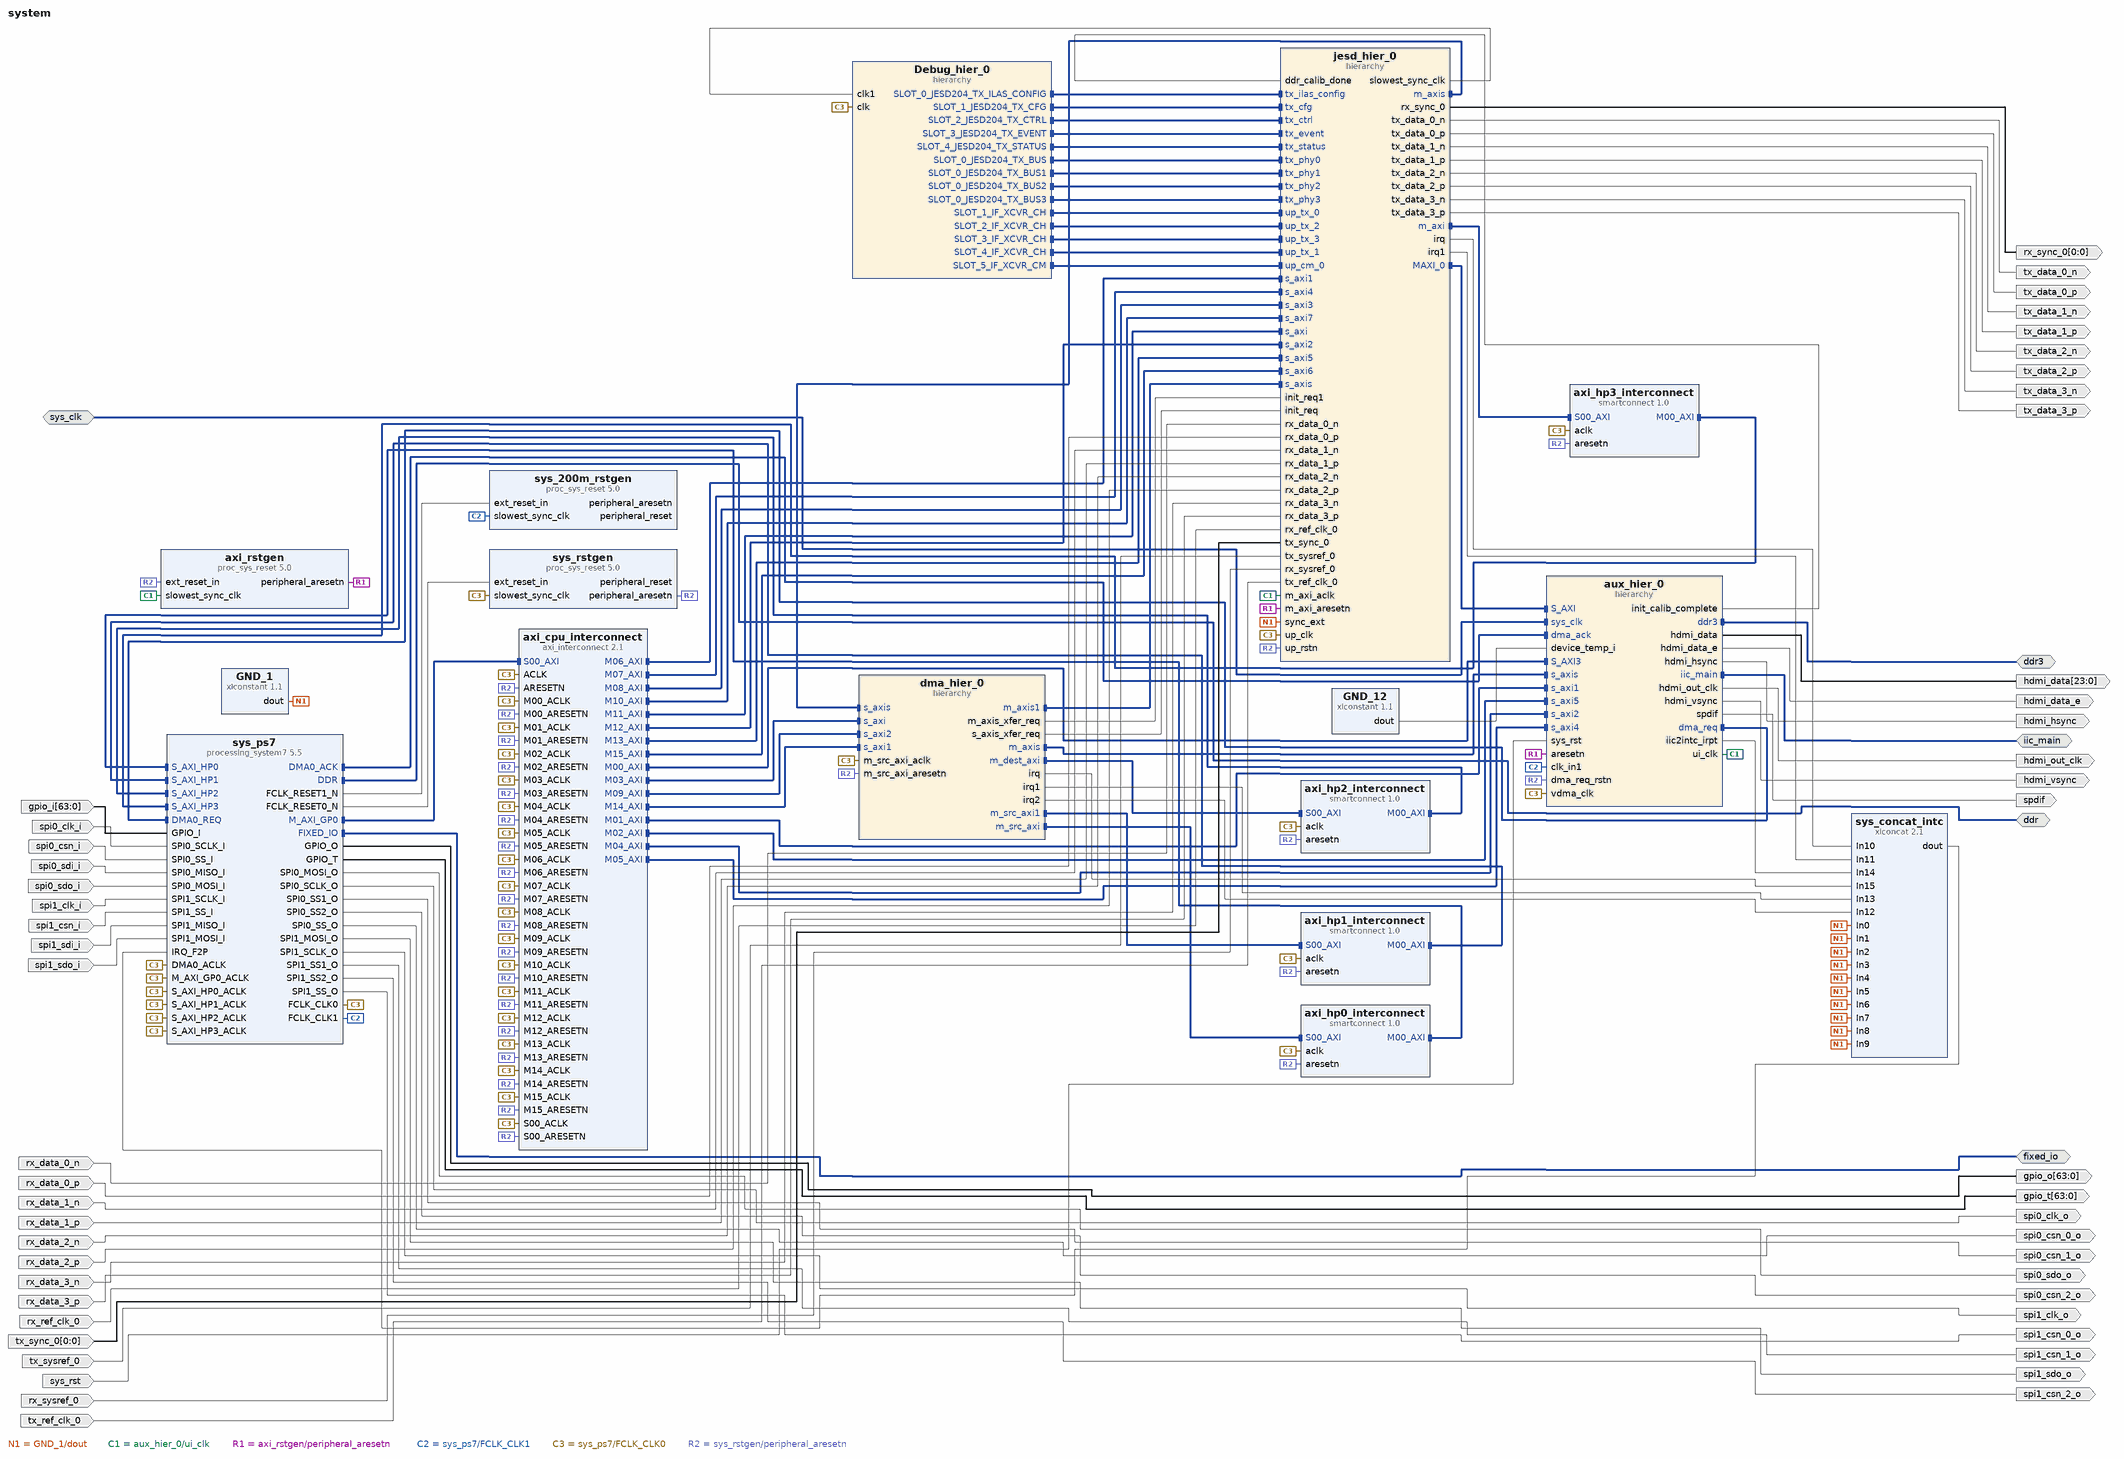
[diagram p0: block diagram of the top level]
# Vivado block design system, xc7z045ffg900-2, Vivado 2022.2
create_bd_design system

create_bd_intf_port -mode Master -vlnv xilinx.com:interface:ddrx_rtl:1.0 ddr
create_bd_intf_port -mode Master -vlnv xilinx.com:interface:iic_rtl:1.0 iic_main
create_bd_intf_port -mode Master -vlnv xilinx.com:display_processing_system7:fixedio_rtl:1.0 fixed_io
create_bd_intf_port -mode Slave -vlnv xilinx.com:interface:diff_clock_rtl:1.0 sys_clk
create_bd_intf_port -mode Master -vlnv xilinx.com:interface:ddrx_rtl:1.0 ddr3
create_bd_port -dir O spi0_csn_2_o
create_bd_port -dir O spi0_csn_1_o
create_bd_port -dir O spi0_csn_0_o
create_bd_port -dir I spi0_csn_i
create_bd_port -dir I spi0_clk_i
create_bd_port -dir O spi0_clk_o
create_bd_port -dir I spi0_sdo_i
create_bd_port -dir O spi0_sdo_o
create_bd_port -dir I spi0_sdi_i
create_bd_port -dir O spi1_csn_2_o
create_bd_port -dir O spi1_csn_1_o
create_bd_port -dir O spi1_csn_0_o
create_bd_port -dir I spi1_csn_i
create_bd_port -dir I spi1_clk_i
create_bd_port -dir O spi1_clk_o
create_bd_port -dir I spi1_sdo_i
create_bd_port -dir O spi1_sdo_o
create_bd_port -dir I spi1_sdi_i
create_bd_port -dir I -from 63 -to 0 gpio_i
create_bd_port -dir O -from 63 -to 0 gpio_o
create_bd_port -dir O -from 63 -to 0 gpio_t
create_bd_port -dir O hdmi_out_clk
create_bd_port -dir O hdmi_hsync
create_bd_port -dir O hdmi_vsync
create_bd_port -dir O hdmi_data_e
create_bd_port -dir O -from 23 -to 0 hdmi_data
create_bd_port -dir O spdif
create_bd_port -dir I tx_ref_clk_0
create_bd_port -dir I rx_ref_clk_0
create_bd_port -dir I tx_sysref_0
create_bd_port -dir I -from 0 -to 0 tx_sync_0
create_bd_port -dir O tx_data_0_p
create_bd_port -dir O tx_data_0_n
create_bd_port -dir O tx_data_1_p
create_bd_port -dir O tx_data_1_n
create_bd_port -dir O tx_data_2_p
create_bd_port -dir O tx_data_2_n
create_bd_port -dir O tx_data_3_p
create_bd_port -dir O tx_data_3_n
create_bd_port -dir I rx_sysref_0
create_bd_port -dir O -from 0 -to 0 rx_sync_0
create_bd_port -dir I rx_data_0_p
create_bd_port -dir I rx_data_0_n
create_bd_port -dir I rx_data_1_p
create_bd_port -dir I rx_data_1_n
create_bd_port -dir I rx_data_2_p
create_bd_port -dir I rx_data_2_n
create_bd_port -dir I rx_data_3_p
create_bd_port -dir I rx_data_3_n
create_bd_port -dir I -type rst sys_rst
set_property -dict {CONFIG.POLARITY ACTIVE_HIGH} [get_bd_ports sys_rst]

create_bd_cell -type ip -vlnv xilinx.com:ip:processing_system7:5.5 sys_ps7
set_property -dict [list \
  CONFIG.PCW_APU_PERIPHERAL_FREQMHZ 667.000000 \
  CONFIG.PCW_DUAL_PARALLEL_QSPI_DATA_MODE x8 \
  CONFIG.PCW_ENET0_ENET0_IO {MIO 16 .. 27} \
  CONFIG.PCW_ENET0_GRP_MDIO_ENABLE 1 \
  CONFIG.PCW_ENET0_GRP_MDIO_IO {MIO 52 .. 53} \
  CONFIG.PCW_ENET0_PERIPHERAL_ENABLE 1 \
  CONFIG.PCW_ENET0_PERIPHERAL_FREQMHZ {100 Mbps} \
  CONFIG.PCW_ENET0_RESET_ENABLE 1 \
  CONFIG.PCW_ENET0_RESET_IO {MIO 47} \
  CONFIG.PCW_ENET_RESET_ENABLE 1 \
  CONFIG.PCW_ENET_RESET_SELECT {Share reset pin} \
  CONFIG.PCW_EN_CLK1_PORT 1 \
  CONFIG.PCW_EN_CLK2_PORT 1 \
  CONFIG.PCW_EN_RST1_PORT 1 \
  CONFIG.PCW_EN_RST2_PORT 1 \
  CONFIG.PCW_FCLK_CLK1_BUF TRUE \
  CONFIG.PCW_FCLK_CLK2_BUF TRUE \
  CONFIG.PCW_FPGA0_PERIPHERAL_FREQMHZ 100.0 \
  CONFIG.PCW_FPGA1_PERIPHERAL_FREQMHZ 200.0 \
  CONFIG.PCW_FPGA_FCLK1_ENABLE 1 \
  CONFIG.PCW_FPGA_FCLK2_ENABLE 1 \
  CONFIG.PCW_GPIO_EMIO_GPIO_ENABLE 1 \
  CONFIG.PCW_GPIO_EMIO_GPIO_IO 64 \
  CONFIG.PCW_GPIO_MIO_GPIO_ENABLE 1 \
  CONFIG.PCW_GPIO_MIO_GPIO_IO MIO \
  CONFIG.PCW_I2C0_GRP_INT_ENABLE 0 \
  CONFIG.PCW_I2C0_I2C0_IO {MIO 50 .. 51} \
  CONFIG.PCW_I2C0_PERIPHERAL_ENABLE 1 \
  CONFIG.PCW_I2C0_RESET_ENABLE 1 \
  CONFIG.PCW_I2C0_RESET_IO {MIO 46} \
  CONFIG.PCW_I2C_PERIPHERAL_FREQMHZ 111.111115 \
  CONFIG.PCW_I2C_RESET_ENABLE 1 \
  CONFIG.PCW_I2C_RESET_SELECT {Share reset pin} \
  CONFIG.PCW_IRQ_F2P_INTR 1 \
  CONFIG.PCW_IRQ_F2P_MODE REVERSE \
  CONFIG.PCW_PRESET_BANK0_VOLTAGE {LVCMOS 1.8V} \
  CONFIG.PCW_PRESET_BANK1_VOLTAGE {LVCMOS 1.8V} \
  CONFIG.PCW_QSPI_GRP_FBCLK_ENABLE 1 \
  CONFIG.PCW_QSPI_GRP_FBCLK_IO {MIO 8} \
  CONFIG.PCW_QSPI_GRP_IO1_ENABLE 1 \
  CONFIG.PCW_QSPI_GRP_IO1_IO {MIO 0 9 .. 13} \
  CONFIG.PCW_QSPI_GRP_SINGLE_SS_ENABLE 0 \
  CONFIG.PCW_QSPI_INTERNAL_HIGHADDRESS 0xFDFFFFFF \
  CONFIG.PCW_QSPI_PERIPHERAL_ENABLE 1 \
  CONFIG.PCW_QSPI_QSPI_IO {MIO 1 .. 6} \
  CONFIG.PCW_SD0_GRP_CD_ENABLE 1 \
  CONFIG.PCW_SD0_GRP_CD_IO {MIO 14} \
  CONFIG.PCW_SD0_GRP_WP_ENABLE 1 \
  CONFIG.PCW_SD0_GRP_WP_IO {MIO 15} \
  CONFIG.PCW_SD0_PERIPHERAL_ENABLE 1 \
  CONFIG.PCW_SD0_SD0_IO {MIO 40 .. 45} \
  CONFIG.PCW_SDIO_PERIPHERAL_FREQMHZ 50 \
  CONFIG.PCW_SPI0_PERIPHERAL_ENABLE 1 \
  CONFIG.PCW_SPI0_SPI0_IO EMIO \
  CONFIG.PCW_SPI1_PERIPHERAL_ENABLE 1 \
  CONFIG.PCW_SPI1_SPI1_IO EMIO \
  CONFIG.PCW_UART1_PERIPHERAL_ENABLE 1 \
  CONFIG.PCW_UART1_UART1_IO {MIO 48 .. 49} \
  CONFIG.PCW_UART_PERIPHERAL_FREQMHZ 50 \
  CONFIG.PCW_UIPARAM_DDR_FREQ_MHZ 533.333313 \
  CONFIG.PCW_UIPARAM_DDR_PARTNO Custom \
  CONFIG.PCW_USB0_PERIPHERAL_ENABLE 1 \
  CONFIG.PCW_USB0_RESET_ENABLE 1 \
  CONFIG.PCW_USB0_RESET_IO {MIO 7} \
  CONFIG.PCW_USB0_USB0_IO {MIO 28 .. 39} \
  CONFIG.PCW_USB_RESET_ENABLE 1 \
  CONFIG.PCW_USB_RESET_SELECT {Share reset pin} \
  CONFIG.PCW_USE_DMA0 1 \
  CONFIG.PCW_USE_FABRIC_INTERRUPT 1 \
  CONFIG.PCW_USE_S_AXI_HP0 1 \
  CONFIG.PCW_USE_S_AXI_HP1 1 \
  CONFIG.PCW_USE_S_AXI_HP2 1 \
  CONFIG.PCW_USE_S_AXI_HP3 1 \
  CONFIG.preset ZC706 \
] [get_bd_cells sys_ps7]
# 242 more settings of sys_ps7 are not shown: defaults, MIO pin electricals, DDR timing, and values the tool derives
create_bd_cell -type ip -vlnv xilinx.com:ip:xlconcat:2.1 sys_concat_intc
set_property -dict {CONFIG.NUM_PORTS 16} [get_bd_cells sys_concat_intc]
create_bd_cell -type ip -vlnv xilinx.com:ip:proc_sys_reset:5.0 sys_rstgen
set_property -dict {CONFIG.C_EXT_RST_WIDTH 1} [get_bd_cells sys_rstgen]
create_bd_cell -type ip -vlnv xilinx.com:ip:proc_sys_reset:5.0 sys_200m_rstgen
set_property -dict {CONFIG.C_EXT_RST_WIDTH 1} [get_bd_cells sys_200m_rstgen]
create_bd_cell -type ip -vlnv xilinx.com:ip:xlconstant:1.1 GND_1
set_property -dict {CONFIG.CONST_VAL 0 CONFIG.CONST_WIDTH 1} [get_bd_cells GND_1]
create_bd_cell -type ip -vlnv xilinx.com:ip:axi_interconnect:2.1 axi_cpu_interconnect
set_property -dict {CONFIG.NUM_MI 16} [get_bd_cells axi_cpu_interconnect]
create_bd_cell -type ip -vlnv xilinx.com:ip:smartconnect:1.0 axi_hp0_interconnect
set_property -dict {CONFIG.NUM_MI 1 CONFIG.NUM_SI 1} [get_bd_cells axi_hp0_interconnect]
create_bd_cell -type ip -vlnv xilinx.com:ip:smartconnect:1.0 axi_hp3_interconnect
set_property -dict {CONFIG.NUM_MI 1 CONFIG.NUM_SI 1} [get_bd_cells axi_hp3_interconnect]
create_bd_cell -type ip -vlnv xilinx.com:ip:smartconnect:1.0 axi_hp1_interconnect
set_property -dict {CONFIG.NUM_MI 1 CONFIG.NUM_SI 1} [get_bd_cells axi_hp1_interconnect]
create_bd_cell -type ip -vlnv xilinx.com:ip:smartconnect:1.0 axi_hp2_interconnect
set_property -dict {CONFIG.NUM_MI 1 CONFIG.NUM_SI 1} [get_bd_cells axi_hp2_interconnect]
create_bd_cell -type ip -vlnv xilinx.com:ip:proc_sys_reset:5.0 axi_rstgen
create_bd_cell -type ip -vlnv xilinx.com:ip:xlconstant:1.1 GND_12
set_property -dict {CONFIG.CONST_VAL 0 CONFIG.CONST_WIDTH 12} [get_bd_cells GND_12]
create_bd_cell -type hier Debug_hier_0
create_bd_cell -type hier jesd_hier_0
create_bd_cell -type hier aux_hier_0
create_bd_cell -type hier dma_hier_0

# ---- hierarchy /Debug_hier_0 ----
current_bd_instance /Debug_hier_0
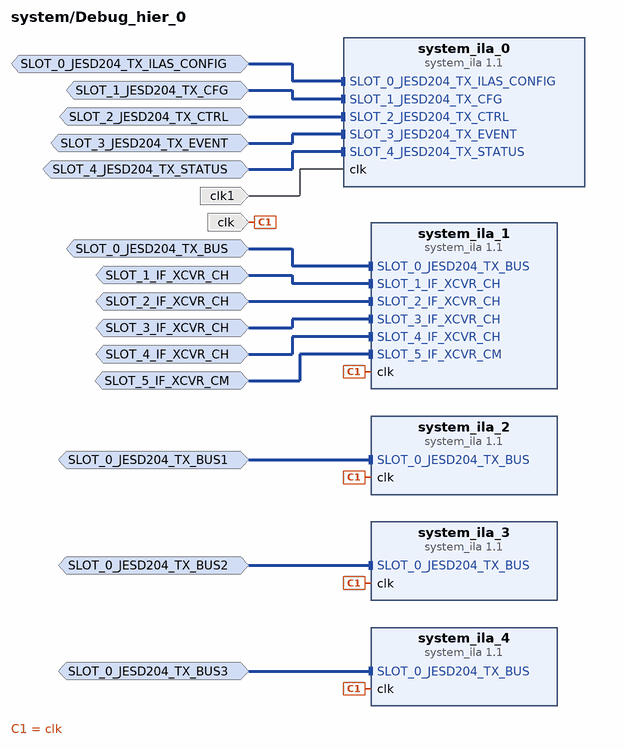
[diagram p1: block diagram inside /Debug_hier_0]
create_bd_intf_pin -mode Monitor -vlnv xilinx.com:display_jesd204:jesd204_tx_bus_rtl:1.0 SLOT_0_JESD204_TX_BUS
create_bd_intf_pin -mode Monitor -vlnv analog.com:interface:if_xcvr_ch_rtl:1.0 SLOT_1_IF_XCVR_CH
create_bd_intf_pin -mode Monitor -vlnv analog.com:interface:if_xcvr_ch_rtl:1.0 SLOT_2_IF_XCVR_CH
create_bd_intf_pin -mode Monitor -vlnv analog.com:interface:if_xcvr_ch_rtl:1.0 SLOT_3_IF_XCVR_CH
create_bd_intf_pin -mode Monitor -vlnv analog.com:interface:if_xcvr_ch_rtl:1.0 SLOT_4_IF_XCVR_CH
create_bd_intf_pin -mode Monitor -vlnv analog.com:interface:if_xcvr_cm_rtl:1.0 SLOT_5_IF_XCVR_CM
create_bd_intf_pin -mode Monitor -vlnv xilinx.com:display_jesd204:jesd204_tx_bus_rtl:1.0 SLOT_0_JESD204_TX_BUS1
create_bd_intf_pin -mode Monitor -vlnv xilinx.com:display_jesd204:jesd204_tx_bus_rtl:1.0 SLOT_0_JESD204_TX_BUS2
create_bd_intf_pin -mode Monitor -vlnv xilinx.com:display_jesd204:jesd204_tx_bus_rtl:1.0 SLOT_0_JESD204_TX_BUS3
create_bd_intf_pin -mode Monitor -vlnv analog.com:interface:jesd204_tx_ilas_config_rtl:1.0 SLOT_0_JESD204_TX_ILAS_CONFIG
create_bd_intf_pin -mode Monitor -vlnv analog.com:interface:jesd204_tx_cfg_rtl:1.0 SLOT_1_JESD204_TX_CFG
create_bd_intf_pin -mode Monitor -vlnv analog.com:interface:jesd204_tx_ctrl_rtl:1.0 SLOT_2_JESD204_TX_CTRL
create_bd_intf_pin -mode Monitor -vlnv analog.com:interface:jesd204_tx_event_rtl:1.0 SLOT_3_JESD204_TX_EVENT
create_bd_intf_pin -mode Monitor -vlnv analog.com:interface:jesd204_tx_status_rtl:1.0 SLOT_4_JESD204_TX_STATUS
create_bd_pin -dir I -type clk clk
create_bd_pin -dir I -type clk clk1

create_bd_cell -type ip -vlnv xilinx.com:ip:system_ila:1.1 system_ila_1
set_property -dict [list \
  CONFIG.C_MON_TYPE INTERFACE \
  CONFIG.C_NUM_MONITOR_SLOTS 6 \
  CONFIG.C_SLOT_0_INTF_TYPE xilinx.com:display_jesd204:jesd204_tx_bus_rtl:1.0 \
  CONFIG.C_SLOT_0_TYPE 0 \
  CONFIG.C_SLOT_1_INTF_TYPE analog.com:interface:if_xcvr_ch_rtl:1.0 \
  CONFIG.C_SLOT_1_TYPE 0 \
  CONFIG.C_SLOT_2_INTF_TYPE analog.com:interface:if_xcvr_ch_rtl:1.0 \
  CONFIG.C_SLOT_2_TYPE 0 \
  CONFIG.C_SLOT_3_INTF_TYPE analog.com:interface:if_xcvr_ch_rtl:1.0 \
  CONFIG.C_SLOT_3_TYPE 0 \
  CONFIG.C_SLOT_4_INTF_TYPE analog.com:interface:if_xcvr_ch_rtl:1.0 \
  CONFIG.C_SLOT_4_TYPE 0 \
  CONFIG.C_SLOT_5_INTF_TYPE analog.com:interface:if_xcvr_cm_rtl:1.0 \
  CONFIG.C_SLOT_5_TYPE 0 \
] [get_bd_cells system_ila_1]
create_bd_cell -type ip -vlnv xilinx.com:ip:system_ila:1.1 system_ila_2
set_property -dict [list \
  CONFIG.C_MON_TYPE INTERFACE \
  CONFIG.C_NUM_MONITOR_SLOTS 1 \
  CONFIG.C_SLOT_0_INTF_TYPE xilinx.com:display_jesd204:jesd204_tx_bus_rtl:1.0 \
  CONFIG.C_SLOT_0_TYPE 0 \
] [get_bd_cells system_ila_2]
create_bd_cell -type ip -vlnv xilinx.com:ip:system_ila:1.1 system_ila_3
set_property -dict [list \
  CONFIG.C_MON_TYPE INTERFACE \
  CONFIG.C_NUM_MONITOR_SLOTS 1 \
  CONFIG.C_SLOT_0_INTF_TYPE xilinx.com:display_jesd204:jesd204_tx_bus_rtl:1.0 \
  CONFIG.C_SLOT_0_TYPE 0 \
] [get_bd_cells system_ila_3]
create_bd_cell -type ip -vlnv xilinx.com:ip:system_ila:1.1 system_ila_4
set_property -dict [list \
  CONFIG.C_MON_TYPE INTERFACE \
  CONFIG.C_NUM_MONITOR_SLOTS 1 \
  CONFIG.C_SLOT_0_INTF_TYPE xilinx.com:display_jesd204:jesd204_tx_bus_rtl:1.0 \
  CONFIG.C_SLOT_0_TYPE 0 \
] [get_bd_cells system_ila_4]
create_bd_cell -type ip -vlnv xilinx.com:ip:system_ila:1.1 system_ila_0
set_property -dict [list \
  CONFIG.C_MON_TYPE INTERFACE \
  CONFIG.C_NUM_MONITOR_SLOTS 5 \
  CONFIG.C_SLOT_0_INTF_TYPE analog.com:interface:jesd204_tx_ilas_config_rtl:1.0 \
  CONFIG.C_SLOT_0_TYPE 0 \
  CONFIG.C_SLOT_1_INTF_TYPE analog.com:interface:jesd204_tx_cfg_rtl:1.0 \
  CONFIG.C_SLOT_1_TYPE 0 \
  CONFIG.C_SLOT_2_INTF_TYPE analog.com:interface:jesd204_tx_ctrl_rtl:1.0 \
  CONFIG.C_SLOT_2_TYPE 0 \
  CONFIG.C_SLOT_3_INTF_TYPE analog.com:interface:jesd204_tx_event_rtl:1.0 \
  CONFIG.C_SLOT_3_TYPE 0 \
  CONFIG.C_SLOT_4_INTF_TYPE analog.com:interface:jesd204_tx_status_rtl:1.0 \
  CONFIG.C_SLOT_4_TYPE 0 \
] [get_bd_cells system_ila_0]

# ---- hierarchy /jesd_hier_0 ----
current_bd_instance /jesd_hier_0
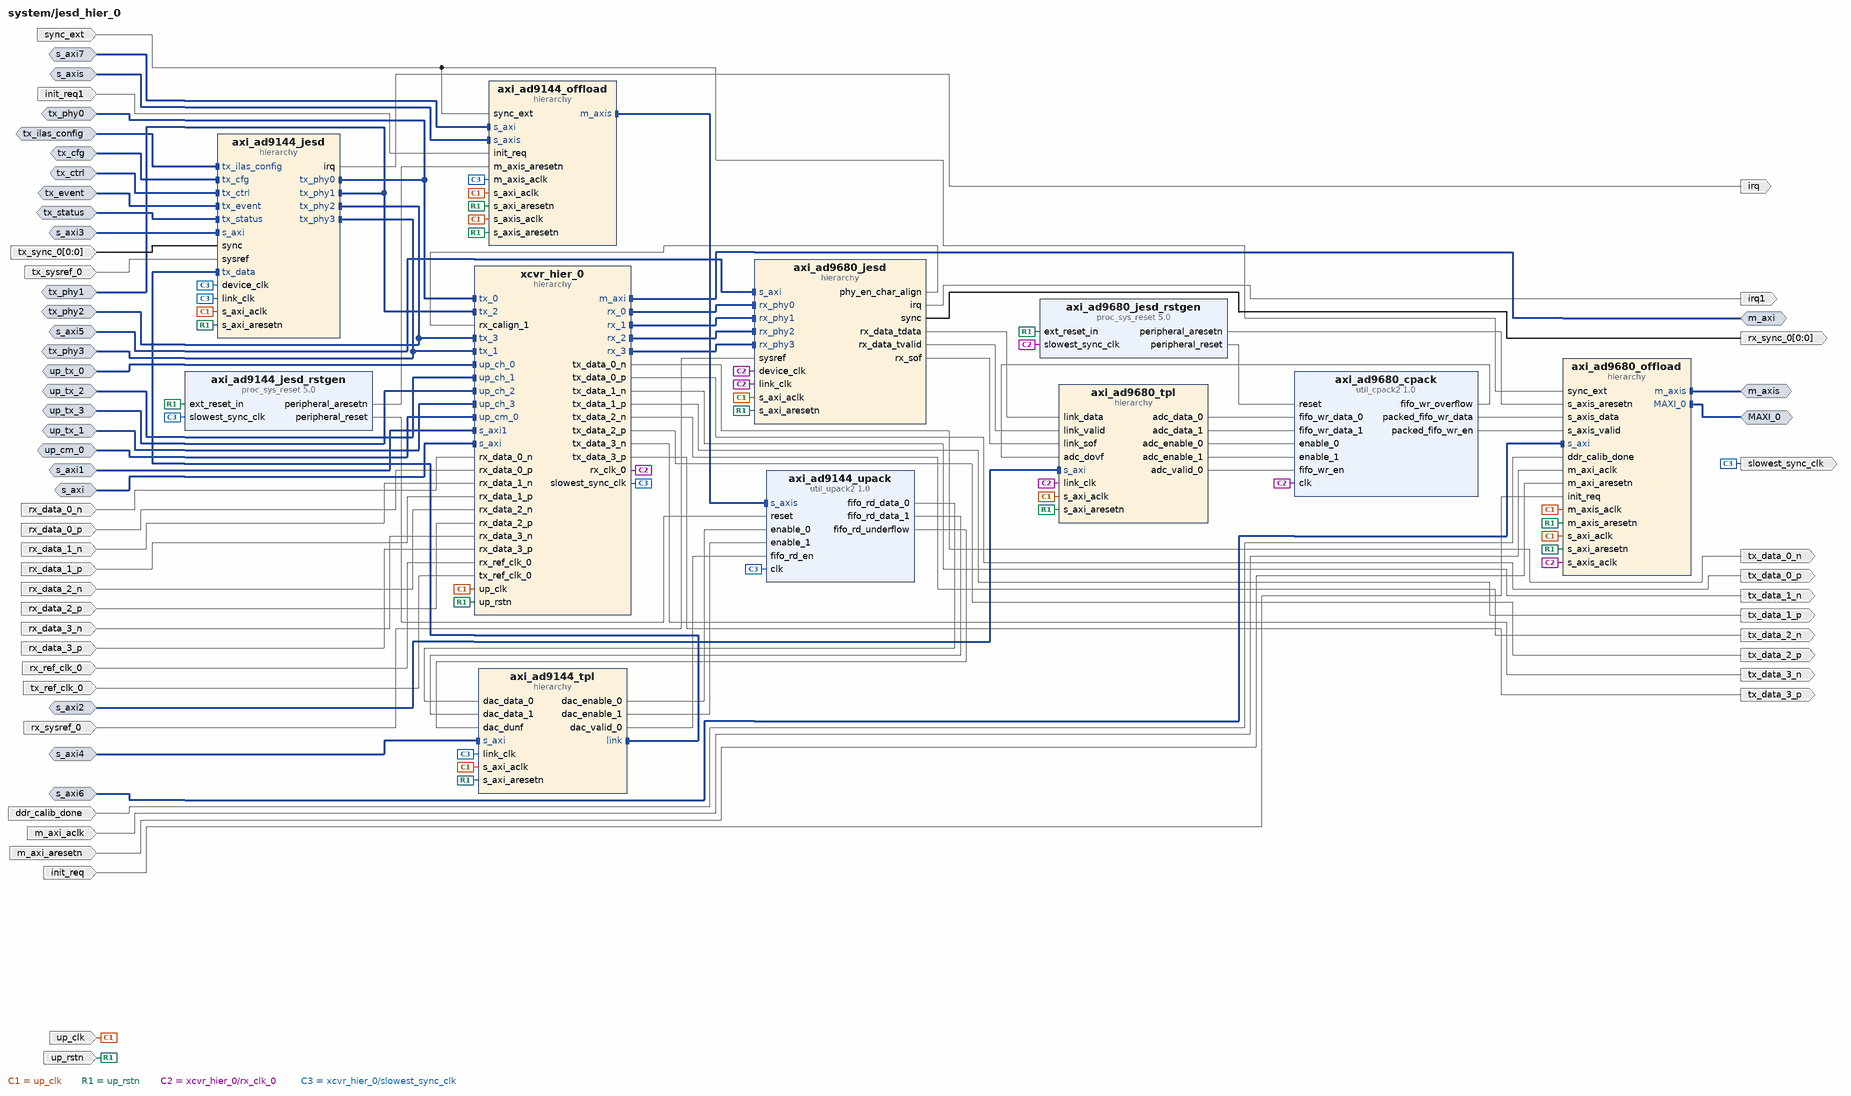
[diagram p2: block diagram inside /jesd_hier_0]
create_bd_intf_pin -mode Slave -vlnv xilinx.com:interface:aximm_rtl:1.0 s_axi
create_bd_intf_pin -mode Master -vlnv xilinx.com:interface:aximm_rtl:1.0 m_axi
create_bd_intf_pin -mode Slave -vlnv xilinx.com:interface:aximm_rtl:1.0 s_axi1
create_bd_intf_pin -mode Monitor -vlnv analog.com:interface:if_xcvr_cm_rtl:1.0 up_cm_0
create_bd_intf_pin -mode Monitor -vlnv analog.com:interface:if_xcvr_ch_rtl:1.0 up_tx_0
create_bd_intf_pin -mode Monitor -vlnv analog.com:interface:if_xcvr_ch_rtl:1.0 up_tx_2
create_bd_intf_pin -mode Monitor -vlnv analog.com:interface:if_xcvr_ch_rtl:1.0 up_tx_3
create_bd_intf_pin -mode Monitor -vlnv analog.com:interface:if_xcvr_ch_rtl:1.0 up_tx_1
create_bd_intf_pin -mode Monitor -vlnv xilinx.com:display_jesd204:jesd204_tx_bus_rtl:1.0 tx_phy0
create_bd_intf_pin -mode Monitor -vlnv xilinx.com:display_jesd204:jesd204_tx_bus_rtl:1.0 tx_phy3
create_bd_intf_pin -mode Monitor -vlnv xilinx.com:display_jesd204:jesd204_tx_bus_rtl:1.0 tx_phy1
create_bd_intf_pin -mode Monitor -vlnv xilinx.com:display_jesd204:jesd204_tx_bus_rtl:1.0 tx_phy2
create_bd_intf_pin -mode Slave -vlnv xilinx.com:interface:aximm_rtl:1.0 s_axi2
create_bd_intf_pin -mode Slave -vlnv xilinx.com:interface:aximm_rtl:1.0 s_axi3
create_bd_intf_pin -mode Monitor -vlnv analog.com:interface:jesd204_tx_ilas_config_rtl:1.0 tx_ilas_config
create_bd_intf_pin -mode Monitor -vlnv analog.com:interface:jesd204_tx_cfg_rtl:1.0 tx_cfg
create_bd_intf_pin -mode Monitor -vlnv analog.com:interface:jesd204_tx_ctrl_rtl:1.0 tx_ctrl
create_bd_intf_pin -mode Monitor -vlnv analog.com:interface:jesd204_tx_event_rtl:1.0 tx_event
create_bd_intf_pin -mode Monitor -vlnv analog.com:interface:jesd204_tx_status_rtl:1.0 tx_status
create_bd_intf_pin -mode Slave -vlnv xilinx.com:interface:aximm_rtl:1.0 s_axi4
create_bd_intf_pin -mode Slave -vlnv xilinx.com:interface:aximm_rtl:1.0 s_axi5
create_bd_intf_pin -mode Slave -vlnv xilinx.com:interface:aximm_rtl:1.0 s_axi6
create_bd_intf_pin -mode Master -vlnv xilinx.com:interface:axis_rtl:1.0 m_axis
create_bd_intf_pin -mode Master -vlnv xilinx.com:interface:aximm_rtl:1.0 MAXI_0
create_bd_intf_pin -mode Slave -vlnv xilinx.com:interface:aximm_rtl:1.0 s_axi7
create_bd_intf_pin -mode Slave -vlnv xilinx.com:interface:axis_rtl:1.0 s_axis
create_bd_pin -dir I -type clk up_clk
create_bd_pin -dir I -type rst up_rstn
create_bd_pin -dir I tx_ref_clk_0
create_bd_pin -dir I rx_ref_clk_0
create_bd_pin -dir I rx_data_0_p
create_bd_pin -dir I rx_data_0_n
create_bd_pin -dir O tx_data_0_p
create_bd_pin -dir O tx_data_0_n
create_bd_pin -dir O -type clk slowest_sync_clk
create_bd_pin -dir I rx_data_1_p
create_bd_pin -dir I rx_data_1_n
create_bd_pin -dir O tx_data_1_p
create_bd_pin -dir O tx_data_1_n
create_bd_pin -dir I rx_data_2_p
create_bd_pin -dir I rx_data_2_n
create_bd_pin -dir O tx_data_2_p
create_bd_pin -dir O tx_data_2_n
create_bd_pin -dir I rx_data_3_p
create_bd_pin -dir I rx_data_3_n
create_bd_pin -dir O tx_data_3_p
create_bd_pin -dir O tx_data_3_n
create_bd_pin -dir O -type intr irq
create_bd_pin -dir I -from 0 -to 0 tx_sync_0
create_bd_pin -dir I tx_sysref_0
create_bd_pin -dir O -type intr irq1
create_bd_pin -dir O -from 0 -to 0 rx_sync_0
create_bd_pin -dir I rx_sysref_0
create_bd_pin -dir I init_req
create_bd_pin -dir I sync_ext
create_bd_pin -dir I -type clk m_axi_aclk
create_bd_pin -dir I -type rst m_axi_aresetn
create_bd_pin -dir I ddr_calib_done
create_bd_pin -dir I init_req1

create_bd_cell -type ip -vlnv analog.com:user:util_cpack2:1.0 axi_ad9680_cpack
set_property -dict [list \
  CONFIG.NUM_OF_CHANNELS 2 \
  CONFIG.SAMPLES_PER_CHANNEL 4 \
  CONFIG.SAMPLE_DATA_WIDTH 16 \
] [get_bd_cells axi_ad9680_cpack]
create_bd_cell -type ip -vlnv xilinx.com:ip:proc_sys_reset:5.0 axi_ad9144_jesd_rstgen
create_bd_cell -type ip -vlnv xilinx.com:ip:proc_sys_reset:5.0 axi_ad9680_jesd_rstgen
create_bd_cell -type ip -vlnv analog.com:user:util_upack2:1.0 axi_ad9144_upack
set_property -dict [list \
  CONFIG.NUM_OF_CHANNELS 2 \
  CONFIG.SAMPLES_PER_CHANNEL 4 \
  CONFIG.SAMPLE_DATA_WIDTH 16 \
] [get_bd_cells axi_ad9144_upack]
create_bd_cell -type hier axi_ad9680_tpl
create_bd_cell -type hier axi_ad9144_jesd
create_bd_cell -type hier axi_ad9144_tpl
create_bd_cell -type hier axi_ad9680_jesd
create_bd_cell -type hier axi_ad9680_offload
create_bd_cell -type hier axi_ad9144_offload
create_bd_cell -type hier xcvr_hier_0

# ---- hierarchy /jesd_hier_0/axi_ad9680_tpl ----
current_bd_instance /jesd_hier_0/axi_ad9680_tpl
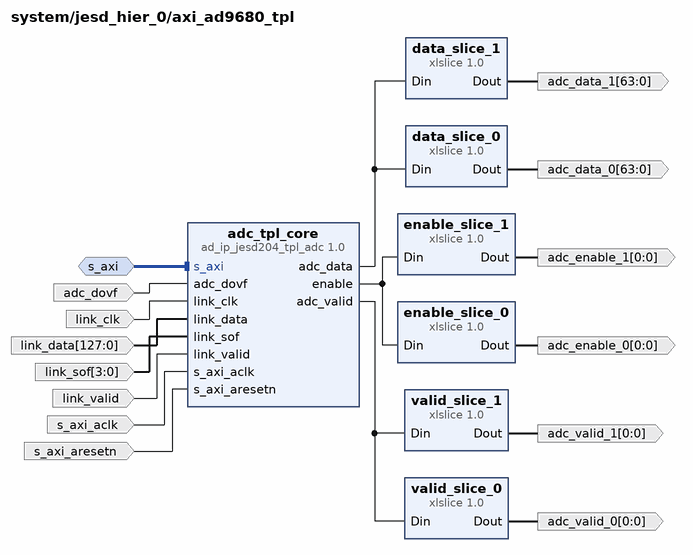
[diagram p3: block diagram inside /jesd_hier_0/axi_ad9680_tpl]
create_bd_intf_pin -mode Slave -vlnv xilinx.com:interface:aximm_rtl:1.0 s_axi
create_bd_pin -dir I -type clk s_axi_aclk
create_bd_pin -dir I -type rst s_axi_aresetn
create_bd_pin -dir I -type clk link_clk
create_bd_pin -dir I -from 3 -to 0 link_sof
create_bd_pin -dir I link_valid
create_bd_pin -dir I -from 127 -to 0 link_data
create_bd_pin -dir I adc_dovf
create_bd_pin -dir O -from 0 -to 0 adc_enable_0
create_bd_pin -dir O -from 0 -to 0 adc_valid_0
create_bd_pin -dir O -from 63 -to 0 adc_data_0
create_bd_pin -dir O -from 0 -to 0 adc_enable_1
create_bd_pin -dir O -from 0 -to 0 adc_valid_1
create_bd_pin -dir O -from 63 -to 0 adc_data_1

create_bd_cell -type ip -vlnv analog.com:user:ad_ip_jesd204_tpl_adc:1.0 adc_tpl_core
set_property -dict [list \
  CONFIG.BITS_PER_SAMPLE 16 \
  CONFIG.CONVERTER_RESOLUTION 14 \
  CONFIG.DMA_BITS_PER_SAMPLE 16 \
  CONFIG.NUM_CHANNELS 2 \
  CONFIG.NUM_LANES 4 \
  CONFIG.OCTETS_PER_BEAT 4 \
  CONFIG.SAMPLES_PER_FRAME 1 \
  CONFIG.TWOS_COMPLEMENT 0 \
] [get_bd_cells adc_tpl_core]
create_bd_cell -type ip -vlnv xilinx.com:ip:xlslice:1.0 data_slice_0
set_property -dict {CONFIG.DIN_FROM 63 CONFIG.DIN_TO 0 CONFIG.DIN_WIDTH 128} [get_bd_cells data_slice_0]
create_bd_cell -type ip -vlnv xilinx.com:ip:xlslice:1.0 enable_slice_0
set_property -dict {CONFIG.DIN_FROM 0 CONFIG.DIN_TO 0 CONFIG.DIN_WIDTH 2} [get_bd_cells enable_slice_0]
create_bd_cell -type ip -vlnv xilinx.com:ip:xlslice:1.0 valid_slice_0
set_property -dict {CONFIG.DIN_FROM 0 CONFIG.DIN_TO 0 CONFIG.DIN_WIDTH 2} [get_bd_cells valid_slice_0]
create_bd_cell -type ip -vlnv xilinx.com:ip:xlslice:1.0 data_slice_1
set_property -dict {CONFIG.DIN_FROM 127 CONFIG.DIN_TO 64 CONFIG.DIN_WIDTH 128} [get_bd_cells data_slice_1]
create_bd_cell -type ip -vlnv xilinx.com:ip:xlslice:1.0 enable_slice_1
set_property -dict {CONFIG.DIN_FROM 1 CONFIG.DIN_TO 1 CONFIG.DIN_WIDTH 2} [get_bd_cells enable_slice_1]
create_bd_cell -type ip -vlnv xilinx.com:ip:xlslice:1.0 valid_slice_1
set_property -dict {CONFIG.DIN_FROM 1 CONFIG.DIN_TO 1 CONFIG.DIN_WIDTH 2} [get_bd_cells valid_slice_1]

# ---- hierarchy /jesd_hier_0/axi_ad9144_jesd ----
current_bd_instance /jesd_hier_0/axi_ad9144_jesd
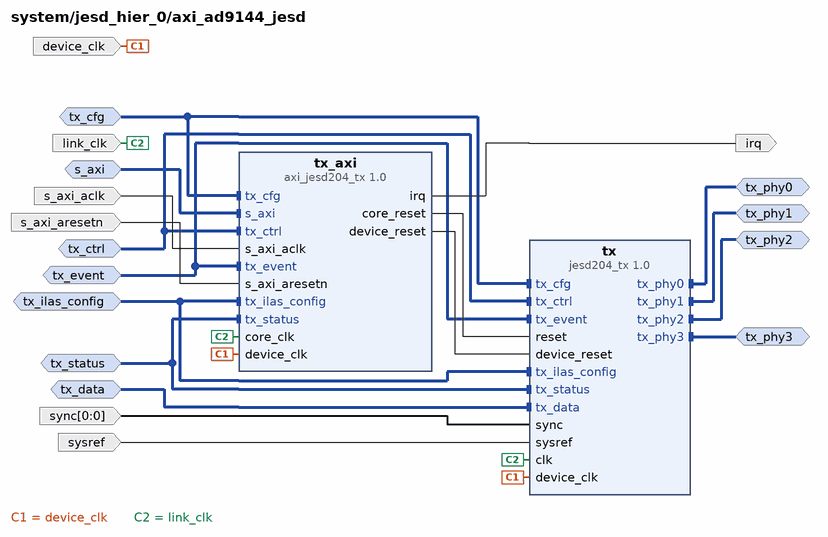
[diagram p4: block diagram inside /jesd_hier_0/axi_ad9144_jesd]
create_bd_intf_pin -mode Slave -vlnv xilinx.com:interface:aximm_rtl:1.0 s_axi
create_bd_intf_pin -mode Slave -vlnv xilinx.com:interface:axis_rtl:1.0 tx_data
create_bd_intf_pin -mode Master -vlnv xilinx.com:display_jesd204:jesd204_tx_bus_rtl:1.0 tx_phy0
create_bd_intf_pin -mode Master -vlnv xilinx.com:display_jesd204:jesd204_tx_bus_rtl:1.0 tx_phy1
create_bd_intf_pin -mode Master -vlnv xilinx.com:display_jesd204:jesd204_tx_bus_rtl:1.0 tx_phy2
create_bd_intf_pin -mode Master -vlnv xilinx.com:display_jesd204:jesd204_tx_bus_rtl:1.0 tx_phy3
create_bd_intf_pin -mode Monitor -vlnv analog.com:interface:jesd204_tx_ilas_config_rtl:1.0 tx_ilas_config
create_bd_intf_pin -mode Monitor -vlnv analog.com:interface:jesd204_tx_cfg_rtl:1.0 tx_cfg
create_bd_intf_pin -mode Monitor -vlnv analog.com:interface:jesd204_tx_ctrl_rtl:1.0 tx_ctrl
create_bd_intf_pin -mode Monitor -vlnv analog.com:interface:jesd204_tx_event_rtl:1.0 tx_event
create_bd_intf_pin -mode Monitor -vlnv analog.com:interface:jesd204_tx_status_rtl:1.0 tx_status
create_bd_pin -dir I -type clk s_axi_aclk
create_bd_pin -dir I -type rst s_axi_aresetn
create_bd_pin -dir O -type intr irq
create_bd_pin -dir I -type clk link_clk
create_bd_pin -dir I -type clk device_clk
create_bd_pin -dir I -from 0 -to 0 sync
create_bd_pin -dir I sysref

create_bd_cell -type ip -vlnv analog.com:user:axi_jesd204_tx:1.0 tx_axi
set_property -dict {CONFIG.LINK_MODE 1 CONFIG.NUM_LANES 4 CONFIG.NUM_LINKS 1} [get_bd_cells tx_axi]
create_bd_cell -type ip -vlnv analog.com:user:jesd204_tx:1.0 tx
set_property -dict {CONFIG.LINK_MODE 1 CONFIG.NUM_LANES 4 CONFIG.NUM_LINKS 1} [get_bd_cells tx]

# ---- hierarchy /jesd_hier_0/axi_ad9144_tpl ----
current_bd_instance /jesd_hier_0/axi_ad9144_tpl
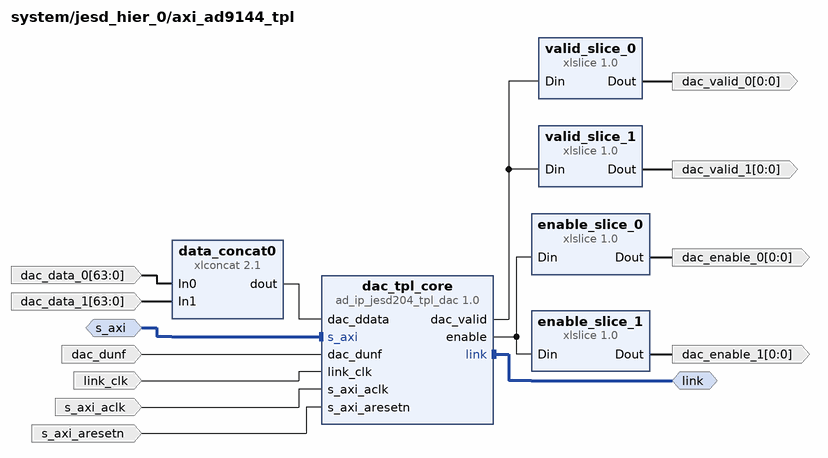
[diagram p5: block diagram inside /jesd_hier_0/axi_ad9144_tpl]
create_bd_intf_pin -mode Slave -vlnv xilinx.com:interface:aximm_rtl:1.0 s_axi
create_bd_intf_pin -mode Master -vlnv xilinx.com:interface:axis_rtl:1.0 link
create_bd_pin -dir I -type clk s_axi_aclk
create_bd_pin -dir I -type rst s_axi_aresetn
create_bd_pin -dir I -type clk link_clk
create_bd_pin -dir I dac_dunf
create_bd_pin -dir O -from 0 -to 0 dac_enable_0
create_bd_pin -dir O -from 0 -to 0 dac_valid_0
create_bd_pin -dir I -from 63 -to 0 dac_data_0
create_bd_pin -dir O -from 0 -to 0 dac_enable_1
create_bd_pin -dir O -from 0 -to 0 dac_valid_1
create_bd_pin -dir I -from 63 -to 0 dac_data_1

create_bd_cell -type ip -vlnv analog.com:user:ad_ip_jesd204_tpl_dac:1.0 dac_tpl_core
set_property -dict [list \
  CONFIG.BITS_PER_SAMPLE 16 \
  CONFIG.CONVERTER_RESOLUTION 16 \
  CONFIG.DMA_BITS_PER_SAMPLE 16 \
  CONFIG.NUM_CHANNELS 2 \
  CONFIG.NUM_LANES 4 \
  CONFIG.OCTETS_PER_BEAT 4 \
  CONFIG.SAMPLES_PER_FRAME 1 \
] [get_bd_cells dac_tpl_core]
create_bd_cell -type ip -vlnv xilinx.com:ip:xlconcat:2.1 data_concat0
set_property -dict {CONFIG.NUM_PORTS 2} [get_bd_cells data_concat0]
create_bd_cell -type ip -vlnv xilinx.com:ip:xlslice:1.0 enable_slice_0
set_property -dict {CONFIG.DIN_FROM 0 CONFIG.DIN_TO 0 CONFIG.DIN_WIDTH 2} [get_bd_cells enable_slice_0]
create_bd_cell -type ip -vlnv xilinx.com:ip:xlslice:1.0 valid_slice_0
set_property -dict {CONFIG.DIN_FROM 0 CONFIG.DIN_TO 0 CONFIG.DIN_WIDTH 2} [get_bd_cells valid_slice_0]
create_bd_cell -type ip -vlnv xilinx.com:ip:xlslice:1.0 enable_slice_1
set_property -dict {CONFIG.DIN_FROM 1 CONFIG.DIN_TO 1 CONFIG.DIN_WIDTH 2} [get_bd_cells enable_slice_1]
create_bd_cell -type ip -vlnv xilinx.com:ip:xlslice:1.0 valid_slice_1
set_property -dict {CONFIG.DIN_FROM 1 CONFIG.DIN_TO 1 CONFIG.DIN_WIDTH 2} [get_bd_cells valid_slice_1]

# ---- hierarchy /jesd_hier_0/axi_ad9680_jesd ----
current_bd_instance /jesd_hier_0/axi_ad9680_jesd
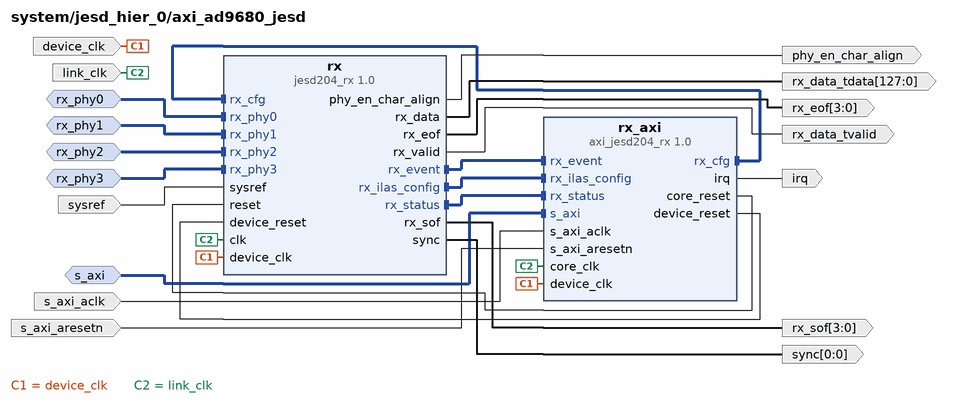
[diagram p6: block diagram inside /jesd_hier_0/axi_ad9680_jesd]
create_bd_intf_pin -mode Slave -vlnv xilinx.com:interface:aximm_rtl:1.0 s_axi
create_bd_intf_pin -mode Slave -vlnv xilinx.com:display_jesd204:jesd204_rx_bus_rtl:1.0 rx_phy0
create_bd_intf_pin -mode Slave -vlnv xilinx.com:display_jesd204:jesd204_rx_bus_rtl:1.0 rx_phy1
create_bd_intf_pin -mode Slave -vlnv xilinx.com:display_jesd204:jesd204_rx_bus_rtl:1.0 rx_phy2
create_bd_intf_pin -mode Slave -vlnv xilinx.com:display_jesd204:jesd204_rx_bus_rtl:1.0 rx_phy3
create_bd_pin -dir I -type clk s_axi_aclk
create_bd_pin -dir I -type rst s_axi_aresetn
create_bd_pin -dir O -type intr irq
create_bd_pin -dir I -type clk link_clk
create_bd_pin -dir I -type clk device_clk
create_bd_pin -dir O -from 0 -to 0 sync
create_bd_pin -dir I sysref
create_bd_pin -dir O phy_en_char_align
create_bd_pin -dir O -from 3 -to 0 rx_eof
create_bd_pin -dir O -from 3 -to 0 rx_sof
create_bd_pin -dir O rx_data_tvalid
create_bd_pin -dir O -from 127 -to 0 rx_data_tdata

create_bd_cell -type ip -vlnv analog.com:user:axi_jesd204_rx:1.0 rx_axi
set_property -dict {CONFIG.LINK_MODE 1 CONFIG.NUM_LANES 4 CONFIG.NUM_LINKS 1} [get_bd_cells rx_axi]
create_bd_cell -type ip -vlnv analog.com:user:jesd204_rx:1.0 rx
set_property -dict {CONFIG.LINK_MODE 1 CONFIG.NUM_LANES 4 CONFIG.NUM_LINKS 1} [get_bd_cells rx]

# ---- hierarchy /jesd_hier_0/axi_ad9680_offload ----
current_bd_instance /jesd_hier_0/axi_ad9680_offload
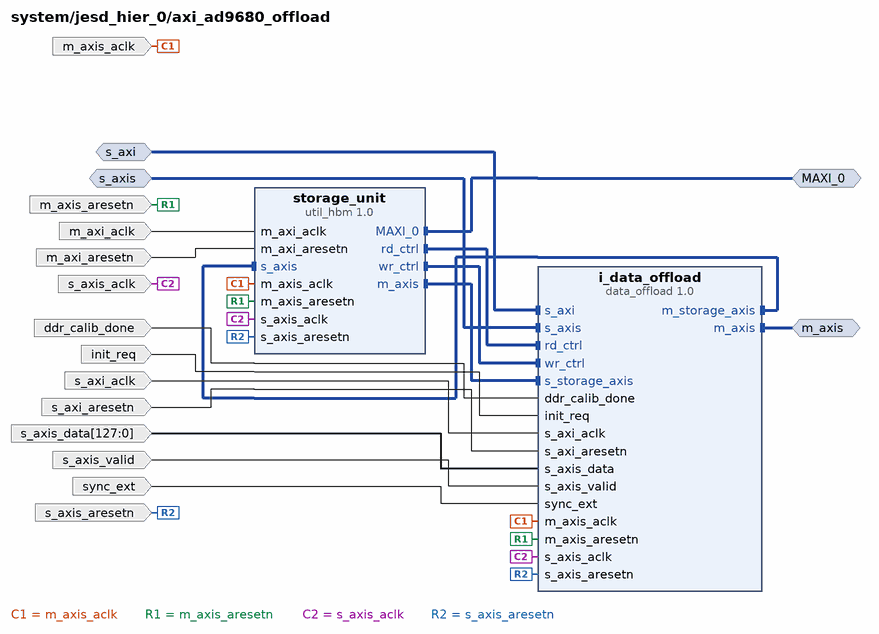
[diagram p7: block diagram inside /jesd_hier_0/axi_ad9680_offload]
create_bd_intf_pin -mode Slave -vlnv xilinx.com:interface:aximm_rtl:1.0 s_axi
create_bd_intf_pin -mode Slave -vlnv xilinx.com:interface:axis_rtl:1.0 s_axis
create_bd_intf_pin -mode Master -vlnv xilinx.com:interface:axis_rtl:1.0 m_axis
create_bd_intf_pin -mode Master -vlnv xilinx.com:interface:aximm_rtl:1.0 MAXI_0
create_bd_pin -dir I -type clk s_axi_aclk
create_bd_pin -dir I -type rst s_axi_aresetn
create_bd_pin -dir I -type clk s_axis_aclk
create_bd_pin -dir I -type rst s_axis_aresetn
create_bd_pin -dir I -type clk m_axis_aclk
create_bd_pin -dir I -type rst m_axis_aresetn
create_bd_pin -dir I init_req
create_bd_pin -dir I sync_ext
create_bd_pin -dir I s_axis_valid
create_bd_pin -dir I -from 127 -to 0 s_axis_data
create_bd_pin -dir I -type clk m_axi_aclk
create_bd_pin -dir I -type rst m_axi_aresetn
create_bd_pin -dir I ddr_calib_done

create_bd_cell -type ip -vlnv analog.com:user:data_offload:1.0 i_data_offload
set_property -dict [list \
  CONFIG.DST_DATA_WIDTH 128 \
  CONFIG.MEM_SIZE_LOG2 30 \
  CONFIG.MEM_TYPE 1 \
  CONFIG.SRC_DATA_WIDTH 128 \
  CONFIG.SYNC_EXT_ADD_INTERNAL_CDC true \
  CONFIG.TX_OR_RXN_PATH 0 \
] [get_bd_cells i_data_offload]
create_bd_cell -type ip -vlnv analog.com:user:util_hbm:1.0 storage_unit
set_property -dict [list \
  CONFIG.AXI_DATA_WIDTH 512 \
  CONFIG.AXI_PROTOCOL 0 \
  CONFIG.DST_DATA_WIDTH 128 \
  CONFIG.LENGTH_WIDTH 30 \
  CONFIG.MEM_TYPE 1 \
  CONFIG.NUM_M 1 \
  CONFIG.SRC_DATA_WIDTH 128 \
  CONFIG.TX_RX_N 0 \
] [get_bd_cells storage_unit]

# ---- hierarchy /jesd_hier_0/axi_ad9144_offload ----
current_bd_instance /jesd_hier_0/axi_ad9144_offload
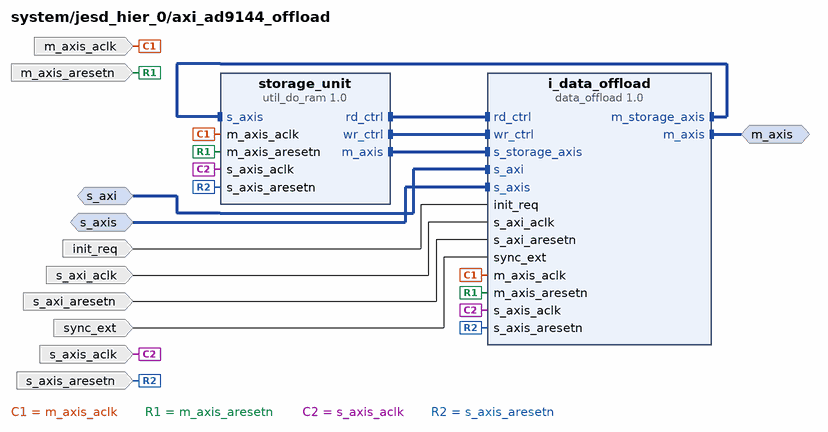
[diagram p8: block diagram inside /jesd_hier_0/axi_ad9144_offload]
create_bd_intf_pin -mode Slave -vlnv xilinx.com:interface:aximm_rtl:1.0 s_axi
create_bd_intf_pin -mode Slave -vlnv xilinx.com:interface:axis_rtl:1.0 s_axis
create_bd_intf_pin -mode Master -vlnv xilinx.com:interface:axis_rtl:1.0 m_axis
create_bd_pin -dir I -type clk s_axi_aclk
create_bd_pin -dir I -type rst s_axi_aresetn
create_bd_pin -dir I -type clk s_axis_aclk
create_bd_pin -dir I -type rst s_axis_aresetn
create_bd_pin -dir I -type clk m_axis_aclk
create_bd_pin -dir I -type rst m_axis_aresetn
create_bd_pin -dir I init_req
create_bd_pin -dir I sync_ext

create_bd_cell -type ip -vlnv analog.com:user:data_offload:1.0 i_data_offload
set_property -dict [list \
  CONFIG.DST_CYCLIC_EN true \
  CONFIG.DST_DATA_WIDTH 128 \
  CONFIG.MEM_SIZE_LOG2 20 \
  CONFIG.MEM_TYPE 0 \
  CONFIG.SRC_DATA_WIDTH 128 \
  CONFIG.SYNC_EXT_ADD_INTERNAL_CDC true \
  CONFIG.TX_OR_RXN_PATH 1 \
] [get_bd_cells i_data_offload]
create_bd_cell -type ip -vlnv analog.com:user:util_do_ram:1.0 storage_unit
set_property -dict {CONFIG.DST_DATA_WIDTH 128 CONFIG.LENGTH_WIDTH 20 CONFIG.SRC_DATA_WIDTH 128} [get_bd_cells storage_unit]

# ---- hierarchy /jesd_hier_0/xcvr_hier_0 ----
current_bd_instance /jesd_hier_0/xcvr_hier_0
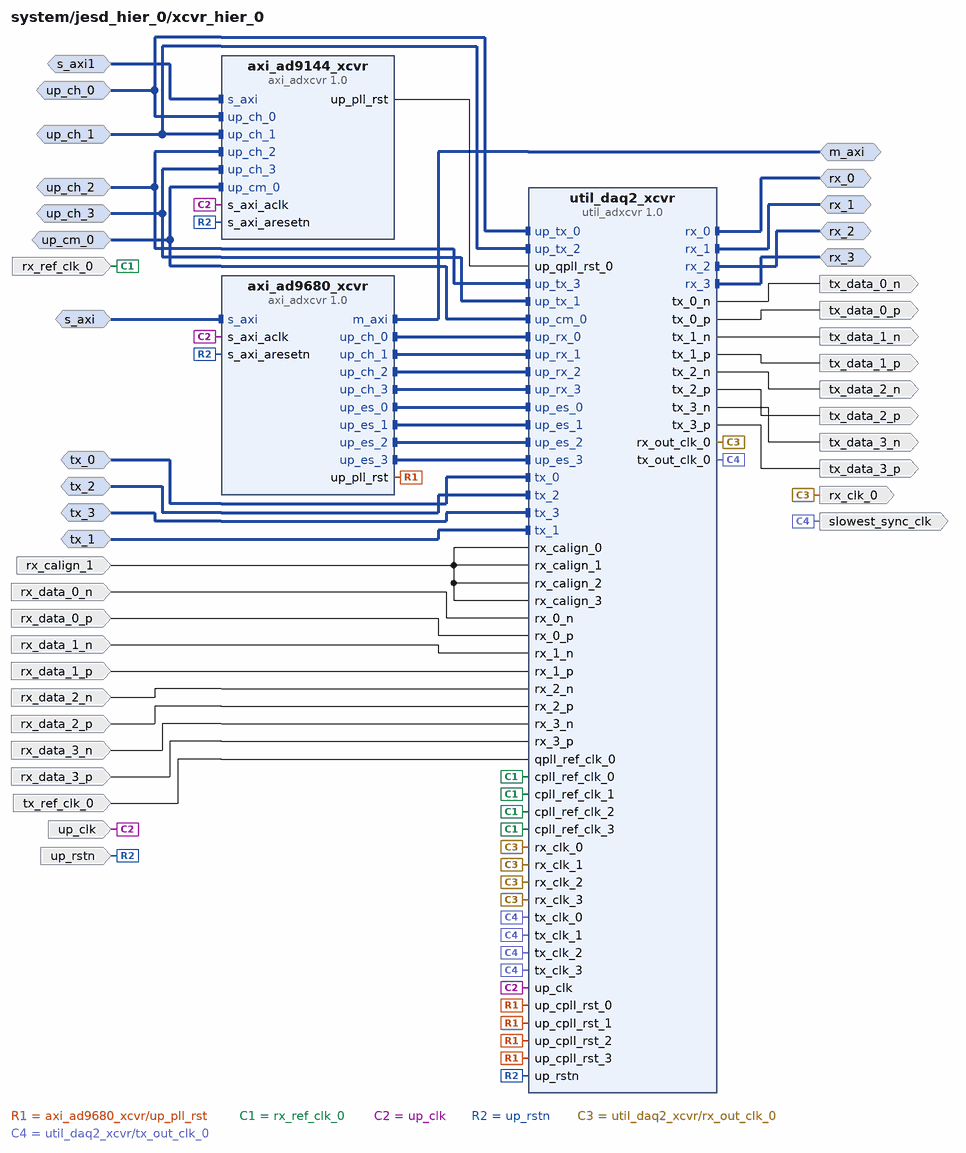
[diagram p9: block diagram inside /jesd_hier_0/xcvr_hier_0]
create_bd_intf_pin -mode Slave -vlnv xilinx.com:interface:aximm_rtl:1.0 s_axi
create_bd_intf_pin -mode Master -vlnv xilinx.com:interface:aximm_rtl:1.0 m_axi
create_bd_intf_pin -mode Monitor -vlnv analog.com:interface:if_xcvr_cm_rtl:1.0 up_cm_0
create_bd_intf_pin -mode Monitor -vlnv analog.com:interface:if_xcvr_ch_rtl:1.0 up_ch_0
create_bd_intf_pin -mode Master -vlnv xilinx.com:display_jesd204:jesd204_rx_bus_rtl:1.0 rx_0
create_bd_intf_pin -mode Slave -vlnv xilinx.com:display_jesd204:jesd204_tx_bus_rtl:1.0 tx_0
create_bd_intf_pin -mode Monitor -vlnv analog.com:interface:if_xcvr_ch_rtl:1.0 up_ch_3
create_bd_intf_pin -mode Master -vlnv xilinx.com:display_jesd204:jesd204_rx_bus_rtl:1.0 rx_1
create_bd_intf_pin -mode Slave -vlnv xilinx.com:display_jesd204:jesd204_tx_bus_rtl:1.0 tx_1
create_bd_intf_pin -mode Monitor -vlnv analog.com:interface:if_xcvr_ch_rtl:1.0 up_ch_1
create_bd_intf_pin -mode Master -vlnv xilinx.com:display_jesd204:jesd204_rx_bus_rtl:1.0 rx_2
create_bd_intf_pin -mode Slave -vlnv xilinx.com:display_jesd204:jesd204_tx_bus_rtl:1.0 tx_2
create_bd_intf_pin -mode Monitor -vlnv analog.com:interface:if_xcvr_ch_rtl:1.0 up_ch_2
create_bd_intf_pin -mode Master -vlnv xilinx.com:display_jesd204:jesd204_rx_bus_rtl:1.0 rx_3
create_bd_intf_pin -mode Slave -vlnv xilinx.com:display_jesd204:jesd204_tx_bus_rtl:1.0 tx_3
create_bd_intf_pin -mode Slave -vlnv xilinx.com:interface:aximm_rtl:1.0 s_axi1
create_bd_pin -dir I -type clk up_clk
create_bd_pin -dir I -type rst up_rstn
create_bd_pin -dir I tx_ref_clk_0
create_bd_pin -dir I rx_ref_clk_0
create_bd_pin -dir I rx_data_0_p
create_bd_pin -dir I rx_data_0_n
create_bd_pin -dir O -type clk rx_clk_0
create_bd_pin -dir I rx_calign_1
create_bd_pin -dir O tx_data_0_p
create_bd_pin -dir O tx_data_0_n
create_bd_pin -dir O -type clk slowest_sync_clk
create_bd_pin -dir I rx_data_1_p
create_bd_pin -dir I rx_data_1_n
create_bd_pin -dir O tx_data_1_p
create_bd_pin -dir O tx_data_1_n
create_bd_pin -dir I rx_data_2_p
create_bd_pin -dir I rx_data_2_n
create_bd_pin -dir O tx_data_2_p
create_bd_pin -dir O tx_data_2_n
create_bd_pin -dir I rx_data_3_p
create_bd_pin -dir I rx_data_3_n
create_bd_pin -dir O tx_data_3_p
create_bd_pin -dir O tx_data_3_n

create_bd_cell -type ip -vlnv analog.com:user:axi_adxcvr:1.0 axi_ad9680_xcvr
set_property -dict {CONFIG.NUM_OF_LANES 4 CONFIG.QPLL_ENABLE 0 CONFIG.TX_OR_RX_N 0} [get_bd_cells axi_ad9680_xcvr]
create_bd_cell -type ip -vlnv analog.com:user:util_adxcvr:1.0 util_daq2_xcvr
set_property -dict [list \
  CONFIG.QPLL_FBDIV 0x030 \
  CONFIG.QPLL_FBDIV_RATIO 1 \
  CONFIG.QPLL_REFCLK_DIV 1 \
  CONFIG.RX_CDR_CFG 0x0B000023FF10400020 \
  CONFIG.RX_DFE_LPM_CFG 0x0104 \
  CONFIG.RX_NUM_OF_LANES 4 \
  CONFIG.RX_OUT_DIV 1 \
  CONFIG.TX_NUM_OF_LANES 4 \
  CONFIG.TX_OUT_DIV 1 \
] [get_bd_cells util_daq2_xcvr]
create_bd_cell -type ip -vlnv analog.com:user:axi_adxcvr:1.0 axi_ad9144_xcvr
set_property -dict {CONFIG.NUM_OF_LANES 4 CONFIG.QPLL_ENABLE 1 CONFIG.TX_OR_RX_N 1} [get_bd_cells axi_ad9144_xcvr]

# ---- hierarchy /aux_hier_0 ----
current_bd_instance /aux_hier_0
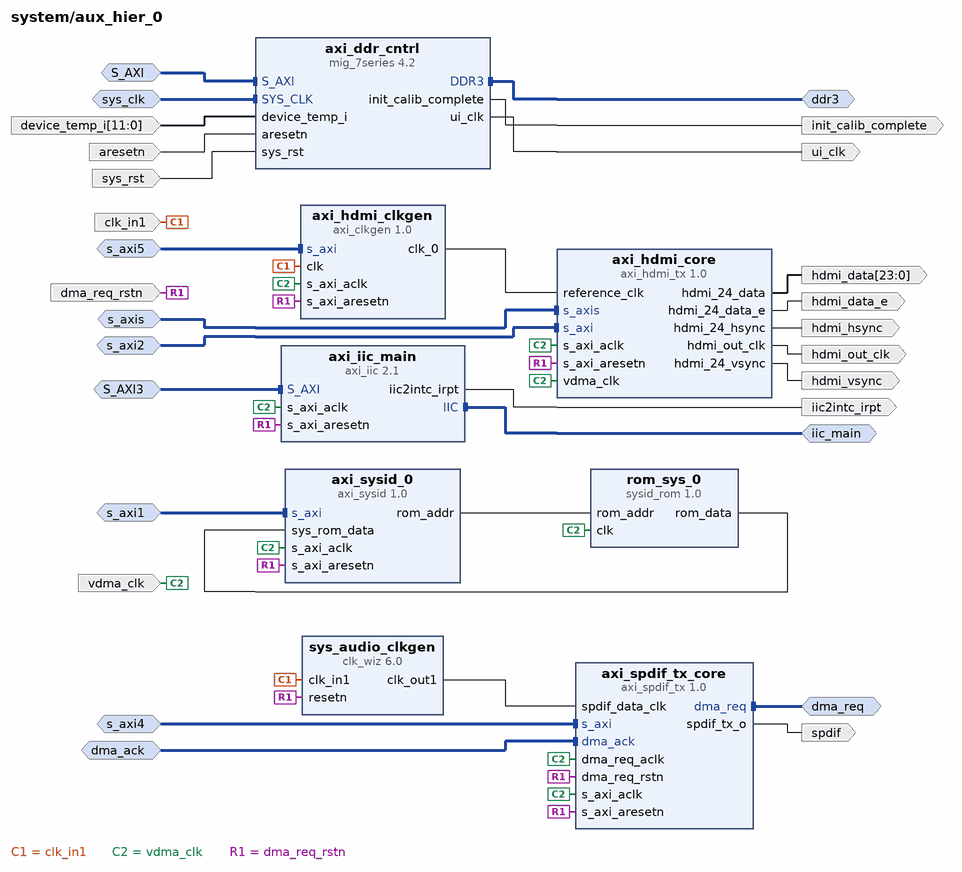
[diagram p10: block diagram inside /aux_hier_0]
create_bd_intf_pin -mode Master -vlnv xilinx.com:interface:ddrx_rtl:1.0 ddr3
create_bd_intf_pin -mode Slave -vlnv xilinx.com:interface:aximm_rtl:1.0 S_AXI
create_bd_intf_pin -mode Slave -vlnv xilinx.com:interface:diff_clock_rtl:1.0 sys_clk
create_bd_intf_pin -mode Slave -vlnv xilinx.com:interface:aximm_rtl:1.0 s_axi1
create_bd_intf_pin -mode Slave -vlnv xilinx.com:interface:aximm_rtl:1.0 s_axi2
create_bd_intf_pin -mode Slave -vlnv xilinx.com:interface:aximm_rtl:1.0 S_AXI3
create_bd_intf_pin -mode Master -vlnv xilinx.com:interface:iic_rtl:1.0 iic_main
create_bd_intf_pin -mode Slave -vlnv xilinx.com:interface:aximm_rtl:1.0 s_axi4
create_bd_intf_pin -mode Slave -vlnv xilinx.com:interface:axis_rtl:1.0 dma_ack
create_bd_intf_pin -mode Master -vlnv xilinx.com:interface:axis_rtl:1.0 dma_req
create_bd_intf_pin -mode Slave -vlnv xilinx.com:interface:aximm_rtl:1.0 s_axi5
create_bd_intf_pin -mode Slave -vlnv xilinx.com:interface:axis_rtl:1.0 s_axis
create_bd_pin -dir I -type clk vdma_clk
create_bd_pin -dir I -from 11 -to 0 device_temp_i
create_bd_pin -dir I -type rst sys_rst
create_bd_pin -dir O -type clk ui_clk
create_bd_pin -dir O init_calib_complete
create_bd_pin -dir I -type rst aresetn
create_bd_pin -dir I -type rst dma_req_rstn
create_bd_pin -dir O -type clk hdmi_out_clk
create_bd_pin -dir O hdmi_hsync
create_bd_pin -dir O hdmi_vsync
create_bd_pin -dir O hdmi_data_e
create_bd_pin -dir O -from 23 -to 0 hdmi_data
create_bd_pin -dir O -type intr iic2intc_irpt
create_bd_pin -dir O spdif
create_bd_pin -dir I -type clk clk_in1

create_bd_cell -type ip -vlnv analog.com:user:sysid_rom:1.0 rom_sys_0
set_property -dict [list \
  CONFIG.PATH_TO_FILE /home/shahamz/FinalProject/AnalogDevicesRepo/hdl/projects/daq2/zc706/mem_init_sys.txt \
  CONFIG.ROM_ADDR_BITS 9 \
] [get_bd_cells rom_sys_0]
create_bd_cell -type ip -vlnv xilinx.com:ip:mig_7series:4.2 axi_ddr_cntrl
set_property -dict {CONFIG.XML_INPUT_FILE zc706_plddr3_mig.prj} [get_bd_cells axi_ddr_cntrl]
create_bd_cell -type ip -vlnv analog.com:user:axi_sysid:1.0 axi_sysid_0
set_property -dict {CONFIG.ROM_ADDR_BITS 9} [get_bd_cells axi_sysid_0]
create_bd_cell -type ip -vlnv analog.com:user:axi_hdmi_tx:1.0 axi_hdmi_core
set_property -dict {CONFIG.INTERFACE 24_BIT} [get_bd_cells axi_hdmi_core]
create_bd_cell -type ip -vlnv xilinx.com:ip:axi_iic:2.1 axi_iic_main
set_property -dict {CONFIG.IIC_BOARD_INTERFACE Custom CONFIG.USE_BOARD_FLOW true} [get_bd_cells axi_iic_main]
create_bd_cell -type ip -vlnv analog.com:user:axi_spdif_tx:1.0 axi_spdif_tx_core
set_property -dict {CONFIG.DMA_TYPE 1 CONFIG.S_AXI_ADDRESS_WIDTH 16} [get_bd_cells axi_spdif_tx_core]
create_bd_cell -type ip -vlnv analog.com:user:axi_clkgen:1.0 axi_hdmi_clkgen
create_bd_cell -type ip -vlnv xilinx.com:ip:clk_wiz:6.0 sys_audio_clkgen
set_property -dict [list \
  CONFIG.CLKOUT1_REQUESTED_OUT_FREQ 12.288 \
  CONFIG.PRIM_SOURCE No_buffer \
  CONFIG.RESET_TYPE ACTIVE_LOW \
  CONFIG.USE_LOCKED false \
  CONFIG.USE_PHASE_ALIGNMENT false \
  CONFIG.USE_RESET true \
] [get_bd_cells sys_audio_clkgen]

# ---- hierarchy /dma_hier_0 ----
current_bd_instance /dma_hier_0
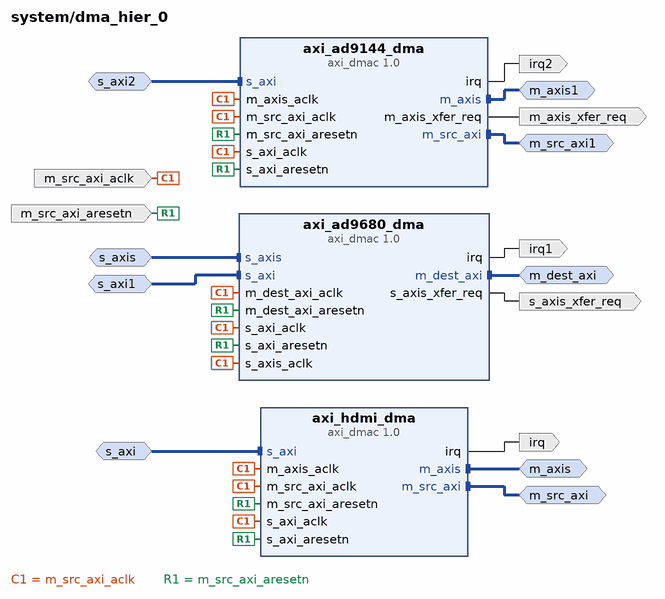
[diagram p11: block diagram inside /dma_hier_0]
create_bd_intf_pin -mode Slave -vlnv xilinx.com:interface:aximm_rtl:1.0 s_axi
create_bd_intf_pin -mode Master -vlnv xilinx.com:interface:aximm_rtl:1.0 m_src_axi
create_bd_intf_pin -mode Master -vlnv xilinx.com:interface:axis_rtl:1.0 m_axis
create_bd_intf_pin -mode Slave -vlnv xilinx.com:interface:aximm_rtl:1.0 s_axi1
create_bd_intf_pin -mode Master -vlnv xilinx.com:interface:aximm_rtl:1.0 m_dest_axi
create_bd_intf_pin -mode Slave -vlnv xilinx.com:interface:axis_rtl:1.0 s_axis
create_bd_intf_pin -mode Slave -vlnv xilinx.com:interface:aximm_rtl:1.0 s_axi2
create_bd_intf_pin -mode Master -vlnv xilinx.com:interface:aximm_rtl:1.0 m_src_axi1
create_bd_intf_pin -mode Master -vlnv xilinx.com:interface:axis_rtl:1.0 m_axis1
create_bd_pin -dir I -type clk m_src_axi_aclk
create_bd_pin -dir I -type rst m_src_axi_aresetn
create_bd_pin -dir O -type intr irq
create_bd_pin -dir O -type intr irq1
create_bd_pin -dir O s_axis_xfer_req
create_bd_pin -dir O -type intr irq2
create_bd_pin -dir O m_axis_xfer_req

create_bd_cell -type ip -vlnv analog.com:user:axi_dmac:1.0 axi_hdmi_dma
set_property -dict [list \
  CONFIG.AXI_SLICE_DEST false \
  CONFIG.AXI_SLICE_SRC false \
  CONFIG.CYCLIC true \
  CONFIG.DMA_2D_TRANSFER true \
  CONFIG.DMA_DATA_WIDTH_SRC 64 \
  CONFIG.DMA_TYPE_DEST 1 \
  CONFIG.DMA_TYPE_SRC 0 \
] [get_bd_cells axi_hdmi_dma]
create_bd_cell -type ip -vlnv analog.com:user:axi_dmac:1.0 axi_ad9680_dma
set_property -dict [list \
  CONFIG.AXI_SLICE_DEST false \
  CONFIG.AXI_SLICE_SRC false \
  CONFIG.CYCLIC false \
  CONFIG.DMA_2D_TRANSFER false \
  CONFIG.DMA_DATA_WIDTH_DEST 64 \
  CONFIG.DMA_DATA_WIDTH_SRC 128 \
  CONFIG.DMA_LENGTH_WIDTH 24 \
  CONFIG.DMA_TYPE_DEST 0 \
  CONFIG.DMA_TYPE_SRC 1 \
  CONFIG.ID 0 \
  CONFIG.SYNC_TRANSFER_START false \
] [get_bd_cells axi_ad9680_dma]
create_bd_cell -type ip -vlnv analog.com:user:axi_dmac:1.0 axi_ad9144_dma
set_property -dict [list \
  CONFIG.AXI_SLICE_DEST false \
  CONFIG.AXI_SLICE_SRC false \
  CONFIG.CYCLIC false \
  CONFIG.DMA_2D_TRANSFER false \
  CONFIG.DMA_DATA_WIDTH_DEST 128 \
  CONFIG.DMA_DATA_WIDTH_SRC 128 \
  CONFIG.DMA_LENGTH_WIDTH 24 \
  CONFIG.DMA_TYPE_DEST 1 \
  CONFIG.DMA_TYPE_SRC 0 \
  CONFIG.ID 1 \
] [get_bd_cells axi_ad9144_dma]

# ---- connections ----

current_bd_instance /Debug_hier_0
connect_bd_intf_net [get_bd_intf_pins SLOT_0_JESD204_TX_ILAS_CONFIG] [get_bd_intf_pins system_ila_0/SLOT_0_JESD204_TX_ILAS_CONFIG]
connect_bd_intf_net [get_bd_intf_pins SLOT_1_JESD204_TX_CFG] [get_bd_intf_pins system_ila_0/SLOT_1_JESD204_TX_CFG]
connect_bd_intf_net [get_bd_intf_pins SLOT_2_JESD204_TX_CTRL] [get_bd_intf_pins system_ila_0/SLOT_2_JESD204_TX_CTRL]
connect_bd_intf_net [get_bd_intf_pins SLOT_3_JESD204_TX_EVENT] [get_bd_intf_pins system_ila_0/SLOT_3_JESD204_TX_EVENT]
connect_bd_intf_net [get_bd_intf_pins SLOT_4_JESD204_TX_STATUS] [get_bd_intf_pins system_ila_0/SLOT_4_JESD204_TX_STATUS]
connect_bd_intf_net [get_bd_intf_pins SLOT_0_JESD204_TX_BUS] [get_bd_intf_pins system_ila_1/SLOT_0_JESD204_TX_BUS]
connect_bd_intf_net [get_bd_intf_pins SLOT_0_JESD204_TX_BUS1] [get_bd_intf_pins system_ila_2/SLOT_0_JESD204_TX_BUS]
connect_bd_intf_net [get_bd_intf_pins SLOT_0_JESD204_TX_BUS2] [get_bd_intf_pins system_ila_3/SLOT_0_JESD204_TX_BUS]
connect_bd_intf_net [get_bd_intf_pins SLOT_0_JESD204_TX_BUS3] [get_bd_intf_pins system_ila_4/SLOT_0_JESD204_TX_BUS]
connect_bd_intf_net [get_bd_intf_pins SLOT_1_IF_XCVR_CH] [get_bd_intf_pins system_ila_1/SLOT_1_IF_XCVR_CH]
connect_bd_intf_net [get_bd_intf_pins SLOT_2_IF_XCVR_CH] [get_bd_intf_pins system_ila_1/SLOT_2_IF_XCVR_CH]
connect_bd_intf_net [get_bd_intf_pins SLOT_3_IF_XCVR_CH] [get_bd_intf_pins system_ila_1/SLOT_3_IF_XCVR_CH]
connect_bd_intf_net [get_bd_intf_pins SLOT_4_IF_XCVR_CH] [get_bd_intf_pins system_ila_1/SLOT_4_IF_XCVR_CH]
connect_bd_intf_net [get_bd_intf_pins SLOT_5_IF_XCVR_CM] [get_bd_intf_pins system_ila_1/SLOT_5_IF_XCVR_CM]
connect_bd_net -net sys_cpu_clk [get_bd_pins clk] \
  [get_bd_pins system_ila_2/clk] [get_bd_pins system_ila_3/clk] [get_bd_pins system_ila_4/clk] [get_bd_pins system_ila_1/clk]
connect_bd_net -net util_daq2_xcvr_tx_out_clk_0 [get_bd_pins clk1] [get_bd_pins system_ila_0/clk]

current_bd_instance /jesd_hier_0
connect_bd_intf_net [get_bd_intf_pins tx_ilas_config] [get_bd_intf_pins axi_ad9144_jesd/tx_ilas_config]
connect_bd_intf_net [get_bd_intf_pins tx_cfg] [get_bd_intf_pins axi_ad9144_jesd/tx_cfg]
connect_bd_intf_net [get_bd_intf_pins tx_ctrl] [get_bd_intf_pins axi_ad9144_jesd/tx_ctrl]
connect_bd_intf_net [get_bd_intf_pins tx_event] [get_bd_intf_pins axi_ad9144_jesd/tx_event]
connect_bd_intf_net [get_bd_intf_pins tx_status] [get_bd_intf_pins axi_ad9144_jesd/tx_status]
connect_bd_intf_net [get_bd_intf_pins axi_ad9144_jesd/tx_phy0] [get_bd_intf_pins xcvr_hier_0/tx_0]
connect_bd_intf_net [get_bd_intf_pins axi_ad9144_jesd/tx_phy0] [get_bd_intf_pins tx_phy0]
connect_bd_intf_net [get_bd_intf_pins axi_ad9144_jesd/tx_phy1] [get_bd_intf_pins xcvr_hier_0/tx_2]
connect_bd_intf_net [get_bd_intf_pins axi_ad9144_jesd/tx_phy1] [get_bd_intf_pins tx_phy1]
connect_bd_intf_net [get_bd_intf_pins axi_ad9144_jesd/tx_phy2] [get_bd_intf_pins xcvr_hier_0/tx_3]
connect_bd_intf_net [get_bd_intf_pins axi_ad9144_jesd/tx_phy2] [get_bd_intf_pins tx_phy2]
connect_bd_intf_net [get_bd_intf_pins axi_ad9144_jesd/tx_phy3] [get_bd_intf_pins xcvr_hier_0/tx_1]
connect_bd_intf_net [get_bd_intf_pins axi_ad9144_jesd/tx_phy3] [get_bd_intf_pins tx_phy3]
connect_bd_intf_net [get_bd_intf_pins axi_ad9144_upack/s_axis] [get_bd_intf_pins axi_ad9144_offload/m_axis]
connect_bd_intf_net [get_bd_intf_pins up_tx_0] [get_bd_intf_pins xcvr_hier_0/up_ch_0]
connect_bd_intf_net [get_bd_intf_pins up_tx_2] [get_bd_intf_pins xcvr_hier_0/up_ch_1]
connect_bd_intf_net [get_bd_intf_pins up_tx_3] [get_bd_intf_pins xcvr_hier_0/up_ch_2]
connect_bd_intf_net [get_bd_intf_pins up_tx_1] [get_bd_intf_pins xcvr_hier_0/up_ch_3]
connect_bd_intf_net [get_bd_intf_pins up_cm_0] [get_bd_intf_pins xcvr_hier_0/up_cm_0]
connect_bd_intf_net [get_bd_intf_pins MAXI_0] [get_bd_intf_pins axi_ad9680_offload/MAXI_0]
connect_bd_intf_net [get_bd_intf_pins m_axis] [get_bd_intf_pins axi_ad9680_offload/m_axis]
connect_bd_intf_net [get_bd_intf_pins m_axi] [get_bd_intf_pins xcvr_hier_0/m_axi]
connect_bd_intf_net [get_bd_intf_pins s_axi1] [get_bd_intf_pins xcvr_hier_0/s_axi1]
connect_bd_intf_net [get_bd_intf_pins s_axi4] [get_bd_intf_pins axi_ad9144_tpl/s_axi]
connect_bd_intf_net [get_bd_intf_pins s_axi3] [get_bd_intf_pins axi_ad9144_jesd/s_axi]
connect_bd_intf_net [get_bd_intf_pins s_axi7] [get_bd_intf_pins axi_ad9144_offload/s_axi]
connect_bd_intf_net [get_bd_intf_pins s_axi] [get_bd_intf_pins xcvr_hier_0/s_axi]
connect_bd_intf_net [get_bd_intf_pins s_axi2] [get_bd_intf_pins axi_ad9680_tpl/s_axi]
connect_bd_intf_net [get_bd_intf_pins s_axi5] [get_bd_intf_pins axi_ad9680_jesd/s_axi]
connect_bd_intf_net [get_bd_intf_pins s_axi6] [get_bd_intf_pins axi_ad9680_offload/s_axi]
connect_bd_intf_net [get_bd_intf_pins s_axis] [get_bd_intf_pins axi_ad9144_offload/s_axis]
connect_bd_intf_net [get_bd_intf_pins axi_ad9144_jesd/tx_data] [get_bd_intf_pins axi_ad9144_tpl/link]
connect_bd_intf_net [get_bd_intf_pins xcvr_hier_0/rx_0] [get_bd_intf_pins axi_ad9680_jesd/rx_phy0]
connect_bd_intf_net [get_bd_intf_pins xcvr_hier_0/rx_1] [get_bd_intf_pins axi_ad9680_jesd/rx_phy1]
connect_bd_intf_net [get_bd_intf_pins xcvr_hier_0/rx_2] [get_bd_intf_pins axi_ad9680_jesd/rx_phy2]
connect_bd_intf_net [get_bd_intf_pins xcvr_hier_0/rx_3] [get_bd_intf_pins axi_ad9680_jesd/rx_phy3]
connect_bd_net -net GND_1_dout [get_bd_pins sync_ext] [get_bd_pins axi_ad9144_offload/sync_ext] [get_bd_pins axi_ad9680_offload/sync_ext]
connect_bd_net -net adc_dovf_1 [get_bd_pins axi_ad9680_cpack/fifo_wr_overflow] [get_bd_pins axi_ad9680_tpl/adc_dovf]
connect_bd_net [get_bd_pins axi_ad9144_jesd/irq] [get_bd_pins irq]
connect_bd_net [get_bd_pins axi_ad9144_jesd_rstgen/peripheral_aresetn] [get_bd_pins axi_ad9144_offload/m_axis_aresetn]
connect_bd_net [get_bd_pins axi_ad9144_jesd_rstgen/peripheral_reset] [get_bd_pins axi_ad9144_upack/reset]
connect_bd_net [get_bd_pins axi_ad9144_tpl/dac_enable_0] [get_bd_pins axi_ad9144_upack/enable_0]
connect_bd_net [get_bd_pins axi_ad9144_tpl/dac_enable_1] [get_bd_pins axi_ad9144_upack/enable_1]
connect_bd_net [get_bd_pins axi_ad9144_tpl/dac_valid_0] [get_bd_pins axi_ad9144_upack/fifo_rd_en]
connect_bd_net [get_bd_pins axi_ad9680_cpack/packed_fifo_wr_data] [get_bd_pins axi_ad9680_offload/s_axis_data]
connect_bd_net [get_bd_pins axi_ad9680_cpack/packed_fifo_wr_en] [get_bd_pins axi_ad9680_offload/s_axis_valid]
connect_bd_net [get_bd_pins axi_ad9680_jesd/irq] [get_bd_pins irq1]
connect_bd_net [get_bd_pins axi_ad9680_jesd/phy_en_char_align] [get_bd_pins xcvr_hier_0/rx_calign_1]
connect_bd_net [get_bd_pins axi_ad9680_jesd_rstgen/peripheral_aresetn] [get_bd_pins axi_ad9680_offload/s_axis_aresetn]
connect_bd_net [get_bd_pins axi_ad9680_jesd_rstgen/peripheral_reset] [get_bd_pins axi_ad9680_cpack/reset]
connect_bd_net [get_bd_pins axi_ad9680_jesd/rx_data_tdata] [get_bd_pins axi_ad9680_tpl/link_data]
connect_bd_net [get_bd_pins axi_ad9680_jesd/rx_data_tvalid] [get_bd_pins axi_ad9680_tpl/link_valid]
connect_bd_net [get_bd_pins axi_ad9680_jesd/rx_sof] [get_bd_pins axi_ad9680_tpl/link_sof]
connect_bd_net [get_bd_pins axi_ad9680_jesd/sync] [get_bd_pins rx_sync_0]
connect_bd_net [get_bd_pins axi_ad9680_tpl/adc_data_0] [get_bd_pins axi_ad9680_cpack/fifo_wr_data_0]
connect_bd_net [get_bd_pins axi_ad9680_tpl/adc_data_1] [get_bd_pins axi_ad9680_cpack/fifo_wr_data_1]
connect_bd_net [get_bd_pins axi_ad9680_tpl/adc_enable_0] [get_bd_pins axi_ad9680_cpack/enable_0]
connect_bd_net [get_bd_pins axi_ad9680_tpl/adc_enable_1] [get_bd_pins axi_ad9680_cpack/enable_1]
connect_bd_net [get_bd_pins axi_ad9680_tpl/adc_valid_0] [get_bd_pins axi_ad9680_cpack/fifo_wr_en]
connect_bd_net -net axi_ddr_cntrl_init_calib_complete [get_bd_pins ddr_calib_done] [get_bd_pins axi_ad9680_offload/ddr_calib_done]
connect_bd_net -net axi_ddr_cntrl_ui_clk [get_bd_pins m_axi_aclk] [get_bd_pins axi_ad9680_offload/m_axi_aclk]
connect_bd_net -net axi_rstgen_peripheral_aresetn [get_bd_pins m_axi_aresetn] [get_bd_pins axi_ad9680_offload/m_axi_aresetn]
connect_bd_net -net dac_data_0_1 [get_bd_pins axi_ad9144_upack/fifo_rd_data_0] [get_bd_pins axi_ad9144_tpl/dac_data_0]
connect_bd_net -net dac_data_1_1 [get_bd_pins axi_ad9144_upack/fifo_rd_data_1] [get_bd_pins axi_ad9144_tpl/dac_data_1]
connect_bd_net -net dac_dunf_1 [get_bd_pins axi_ad9144_upack/fifo_rd_underflow] [get_bd_pins axi_ad9144_tpl/dac_dunf]
connect_bd_net [get_bd_pins init_req1] [get_bd_pins axi_ad9144_offload/init_req]
connect_bd_net [get_bd_pins init_req] [get_bd_pins axi_ad9680_offload/init_req]
connect_bd_net [get_bd_pins rx_data_0_n] [get_bd_pins xcvr_hier_0/rx_data_0_n]
connect_bd_net [get_bd_pins rx_data_0_p] [get_bd_pins xcvr_hier_0/rx_data_0_p]
connect_bd_net [get_bd_pins rx_data_1_n] [get_bd_pins xcvr_hier_0/rx_data_1_n]
connect_bd_net [get_bd_pins rx_data_1_p] [get_bd_pins xcvr_hier_0/rx_data_1_p]
connect_bd_net [get_bd_pins rx_data_2_n] [get_bd_pins xcvr_hier_0/rx_data_2_n]
connect_bd_net [get_bd_pins rx_data_2_p] [get_bd_pins xcvr_hier_0/rx_data_2_p]
connect_bd_net [get_bd_pins rx_data_3_n] [get_bd_pins xcvr_hier_0/rx_data_3_n]
connect_bd_net [get_bd_pins rx_data_3_p] [get_bd_pins xcvr_hier_0/rx_data_3_p]
connect_bd_net -net rx_ref_clk_0_1 [get_bd_pins rx_ref_clk_0] [get_bd_pins xcvr_hier_0/rx_ref_clk_0]
connect_bd_net -net sync_1 [get_bd_pins tx_sync_0] [get_bd_pins axi_ad9144_jesd/sync]
connect_bd_net -net sys_cpu_clk [get_bd_pins up_clk] \
  [get_bd_pins axi_ad9144_offload/s_axi_aclk] [get_bd_pins axi_ad9144_offload/s_axis_aclk] \
  [get_bd_pins axi_ad9680_offload/s_axi_aclk] [get_bd_pins axi_ad9680_offload/m_axis_aclk] \
  [get_bd_pins axi_ad9144_tpl/s_axi_aclk] [get_bd_pins axi_ad9144_jesd/s_axi_aclk] [get_bd_pins axi_ad9680_tpl/s_axi_aclk] \
  [get_bd_pins axi_ad9680_jesd/s_axi_aclk] [get_bd_pins xcvr_hier_0/up_clk]
connect_bd_net -net sys_cpu_resetn [get_bd_pins up_rstn] \
  [get_bd_pins axi_ad9144_jesd_rstgen/ext_reset_in] [get_bd_pins axi_ad9144_offload/s_axi_aresetn] \
  [get_bd_pins axi_ad9144_offload/s_axis_aresetn] [get_bd_pins axi_ad9680_jesd_rstgen/ext_reset_in] \
  [get_bd_pins axi_ad9680_offload/s_axi_aresetn] [get_bd_pins axi_ad9680_offload/m_axis_aresetn] \
  [get_bd_pins axi_ad9144_tpl/s_axi_aresetn] [get_bd_pins axi_ad9144_jesd/s_axi_aresetn] \
  [get_bd_pins axi_ad9680_tpl/s_axi_aresetn] [get_bd_pins axi_ad9680_jesd/s_axi_aresetn] [get_bd_pins xcvr_hier_0/up_rstn]
connect_bd_net -net sysref_1 [get_bd_pins tx_sysref_0] [get_bd_pins axi_ad9144_jesd/sysref]
connect_bd_net -net sysref_2 [get_bd_pins rx_sysref_0] [get_bd_pins axi_ad9680_jesd/sysref]
connect_bd_net -net tx_ref_clk_0_1 [get_bd_pins tx_ref_clk_0] [get_bd_pins xcvr_hier_0/tx_ref_clk_0]
connect_bd_net -net util_daq2_xcvr_rx_out_clk_0 [get_bd_pins xcvr_hier_0/rx_clk_0] \
  [get_bd_pins axi_ad9680_jesd_rstgen/slowest_sync_clk] [get_bd_pins axi_ad9680_jesd/device_clk] \
  [get_bd_pins axi_ad9680_jesd/link_clk] [get_bd_pins axi_ad9680_tpl/link_clk] [get_bd_pins axi_ad9680_cpack/clk] \
  [get_bd_pins axi_ad9680_offload/s_axis_aclk]
connect_bd_net -net util_daq2_xcvr_tx_0_n [get_bd_pins xcvr_hier_0/tx_data_0_n] [get_bd_pins tx_data_0_n]
connect_bd_net -net util_daq2_xcvr_tx_0_p [get_bd_pins xcvr_hier_0/tx_data_0_p] [get_bd_pins tx_data_0_p]
connect_bd_net -net util_daq2_xcvr_tx_1_n [get_bd_pins xcvr_hier_0/tx_data_1_n] [get_bd_pins tx_data_1_n]
connect_bd_net -net util_daq2_xcvr_tx_1_p [get_bd_pins xcvr_hier_0/tx_data_1_p] [get_bd_pins tx_data_1_p]
connect_bd_net -net util_daq2_xcvr_tx_2_n [get_bd_pins xcvr_hier_0/tx_data_2_n] [get_bd_pins tx_data_2_n]
connect_bd_net -net util_daq2_xcvr_tx_2_p [get_bd_pins xcvr_hier_0/tx_data_2_p] [get_bd_pins tx_data_2_p]
connect_bd_net -net util_daq2_xcvr_tx_3_n [get_bd_pins xcvr_hier_0/tx_data_3_n] [get_bd_pins tx_data_3_n]
connect_bd_net -net util_daq2_xcvr_tx_3_p [get_bd_pins xcvr_hier_0/tx_data_3_p] [get_bd_pins tx_data_3_p]
connect_bd_net -net util_daq2_xcvr_tx_out_clk_0 [get_bd_pins xcvr_hier_0/slowest_sync_clk] \
  [get_bd_pins slowest_sync_clk] [get_bd_pins axi_ad9144_jesd_rstgen/slowest_sync_clk] \
  [get_bd_pins axi_ad9144_jesd/device_clk] [get_bd_pins axi_ad9144_jesd/link_clk] [get_bd_pins axi_ad9144_tpl/link_clk] \
  [get_bd_pins axi_ad9144_upack/clk] [get_bd_pins axi_ad9144_offload/m_axis_aclk]
